# Altium project ADAS_ECU_revB.PrjPcb (part 2 of 3)

## Sheet STP_MAX96724_PINOUT.SchDoc
size D; SheetNumber: 4; SheetTotal: 19
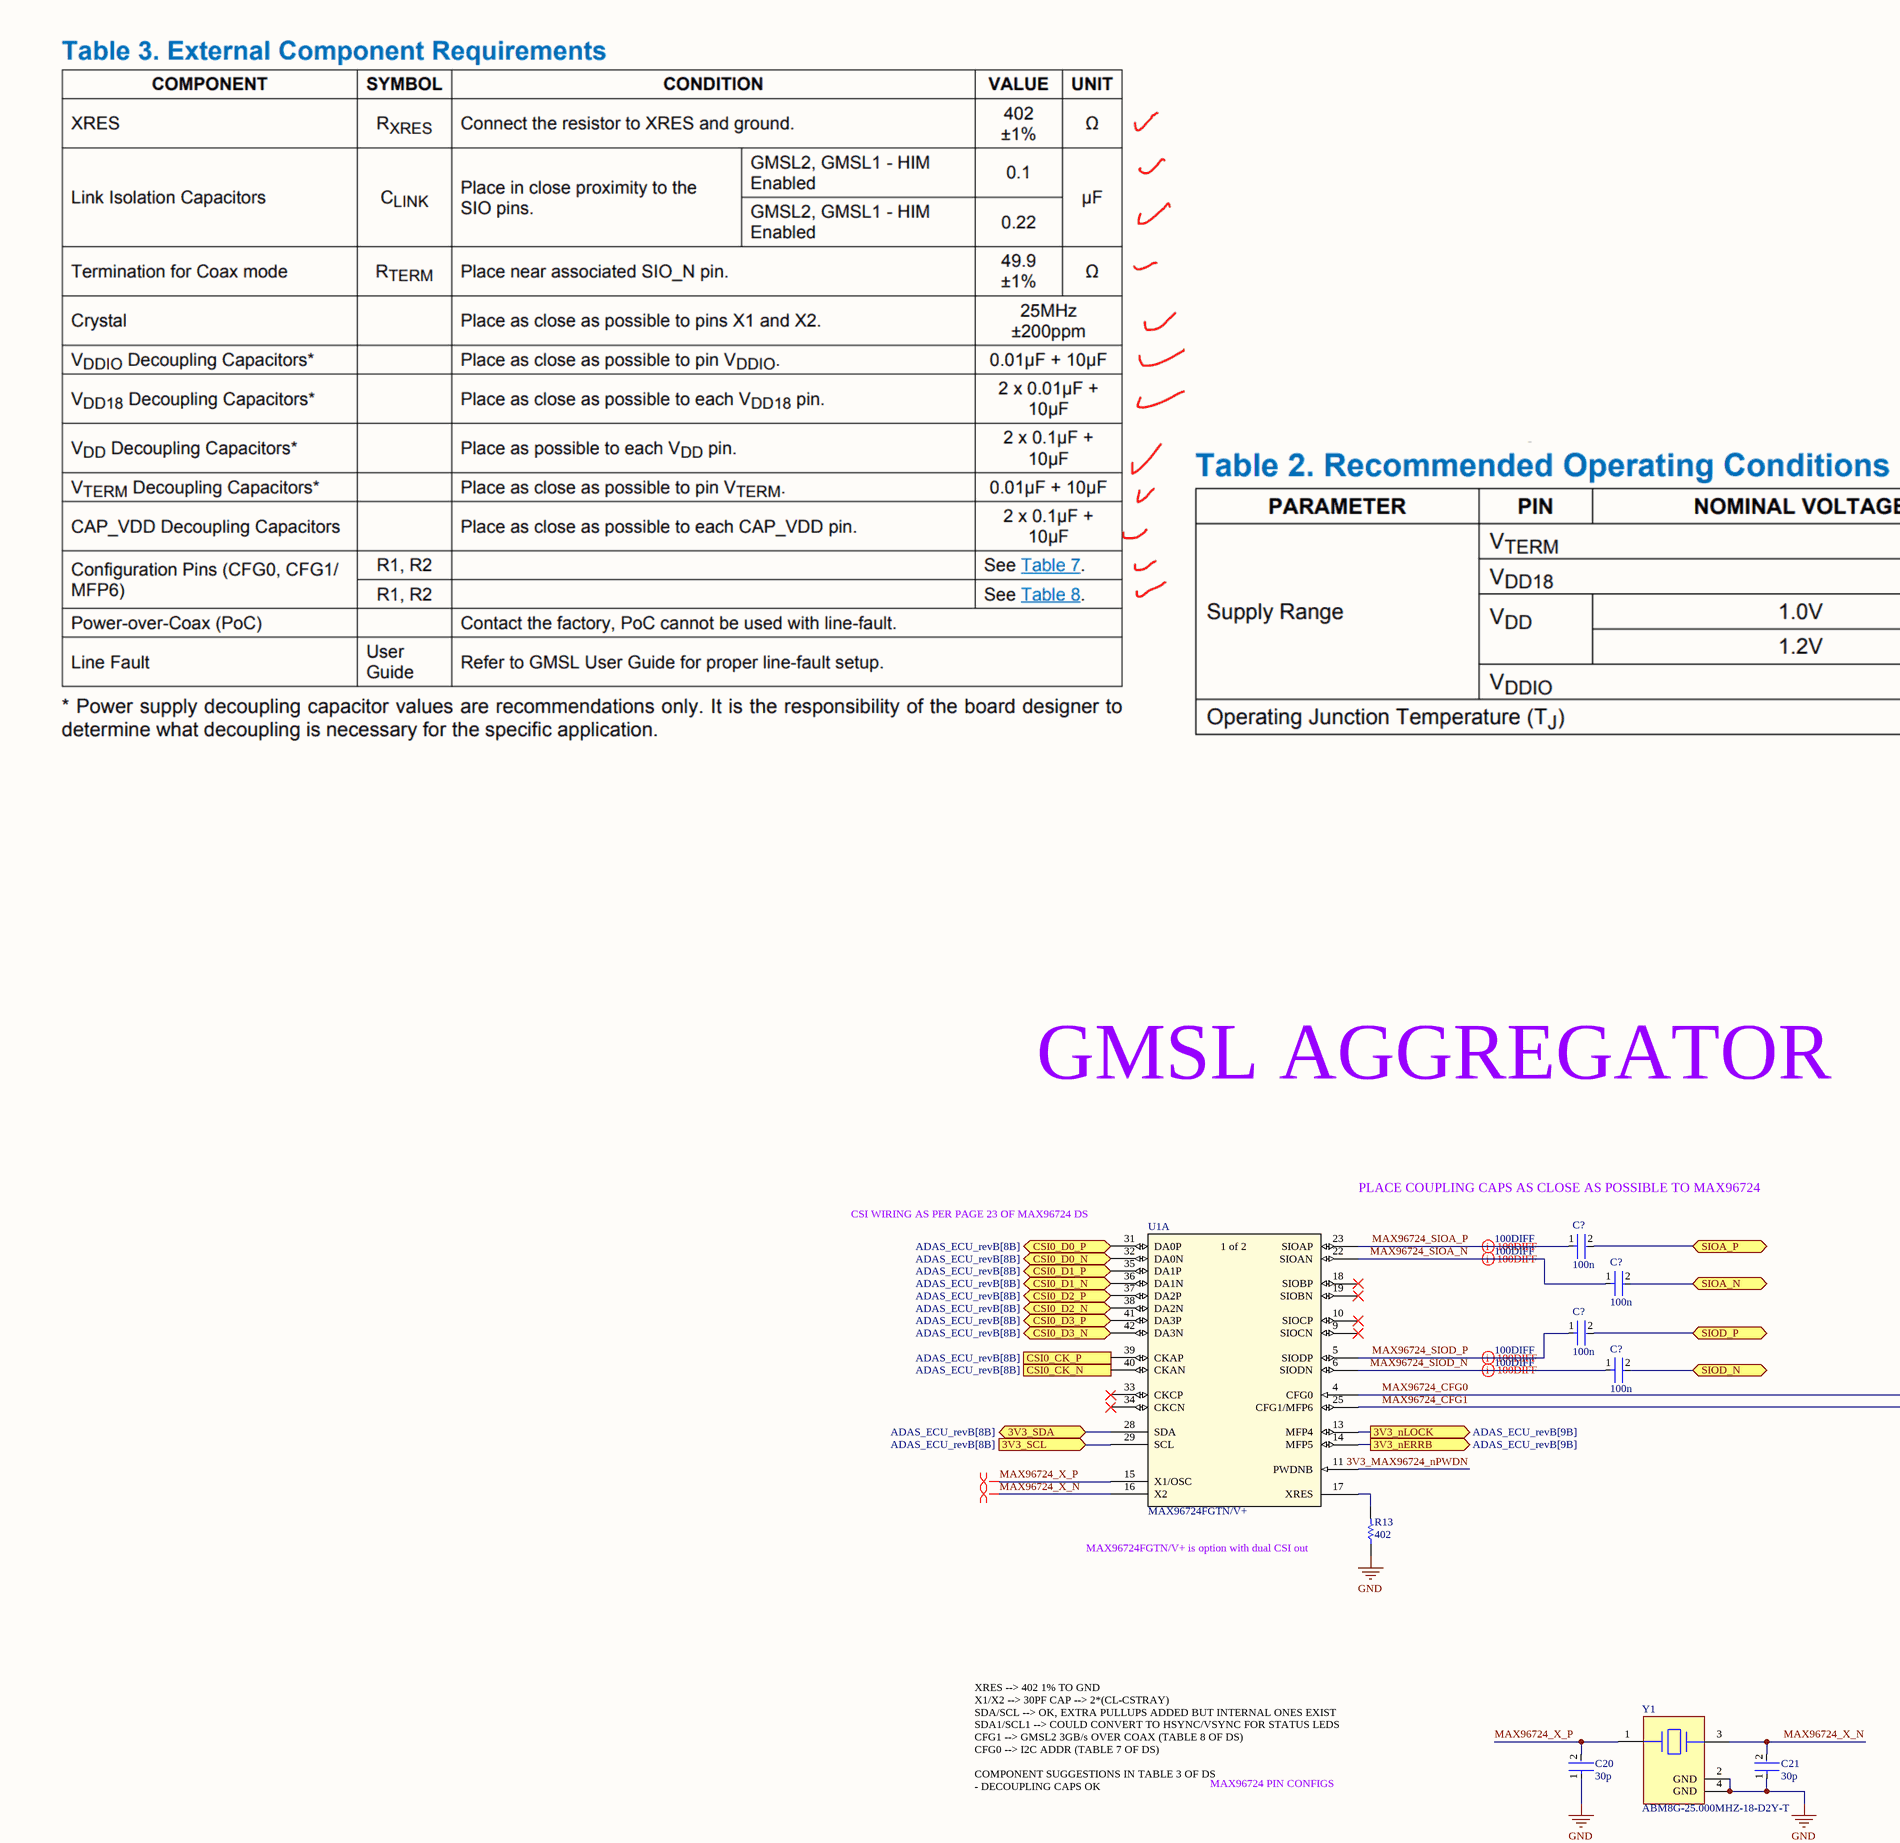
[diagram p10: STP_MAX96724_PINOUT.SchDoc, top left]
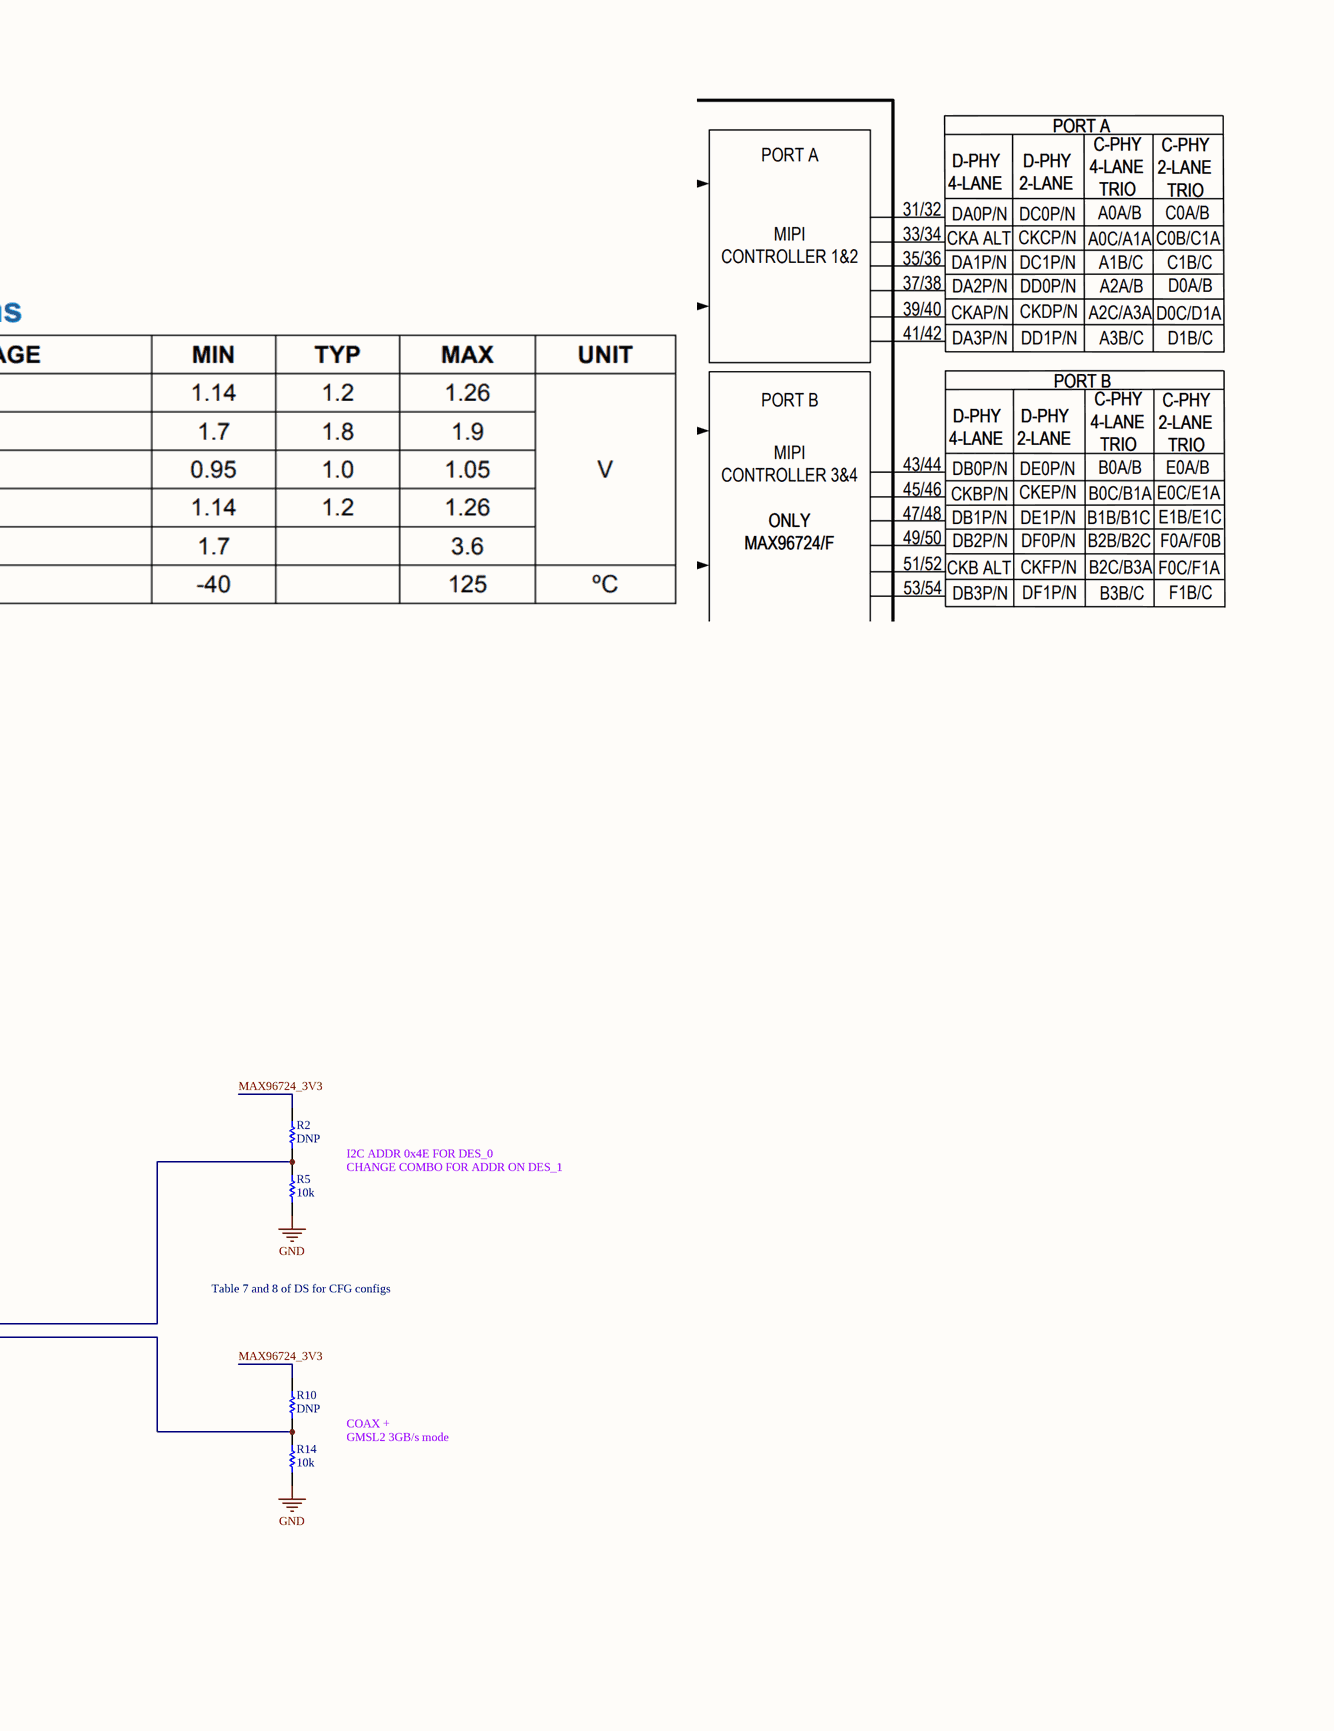
[diagram p11: STP_MAX96724_PINOUT.SchDoc, top right]
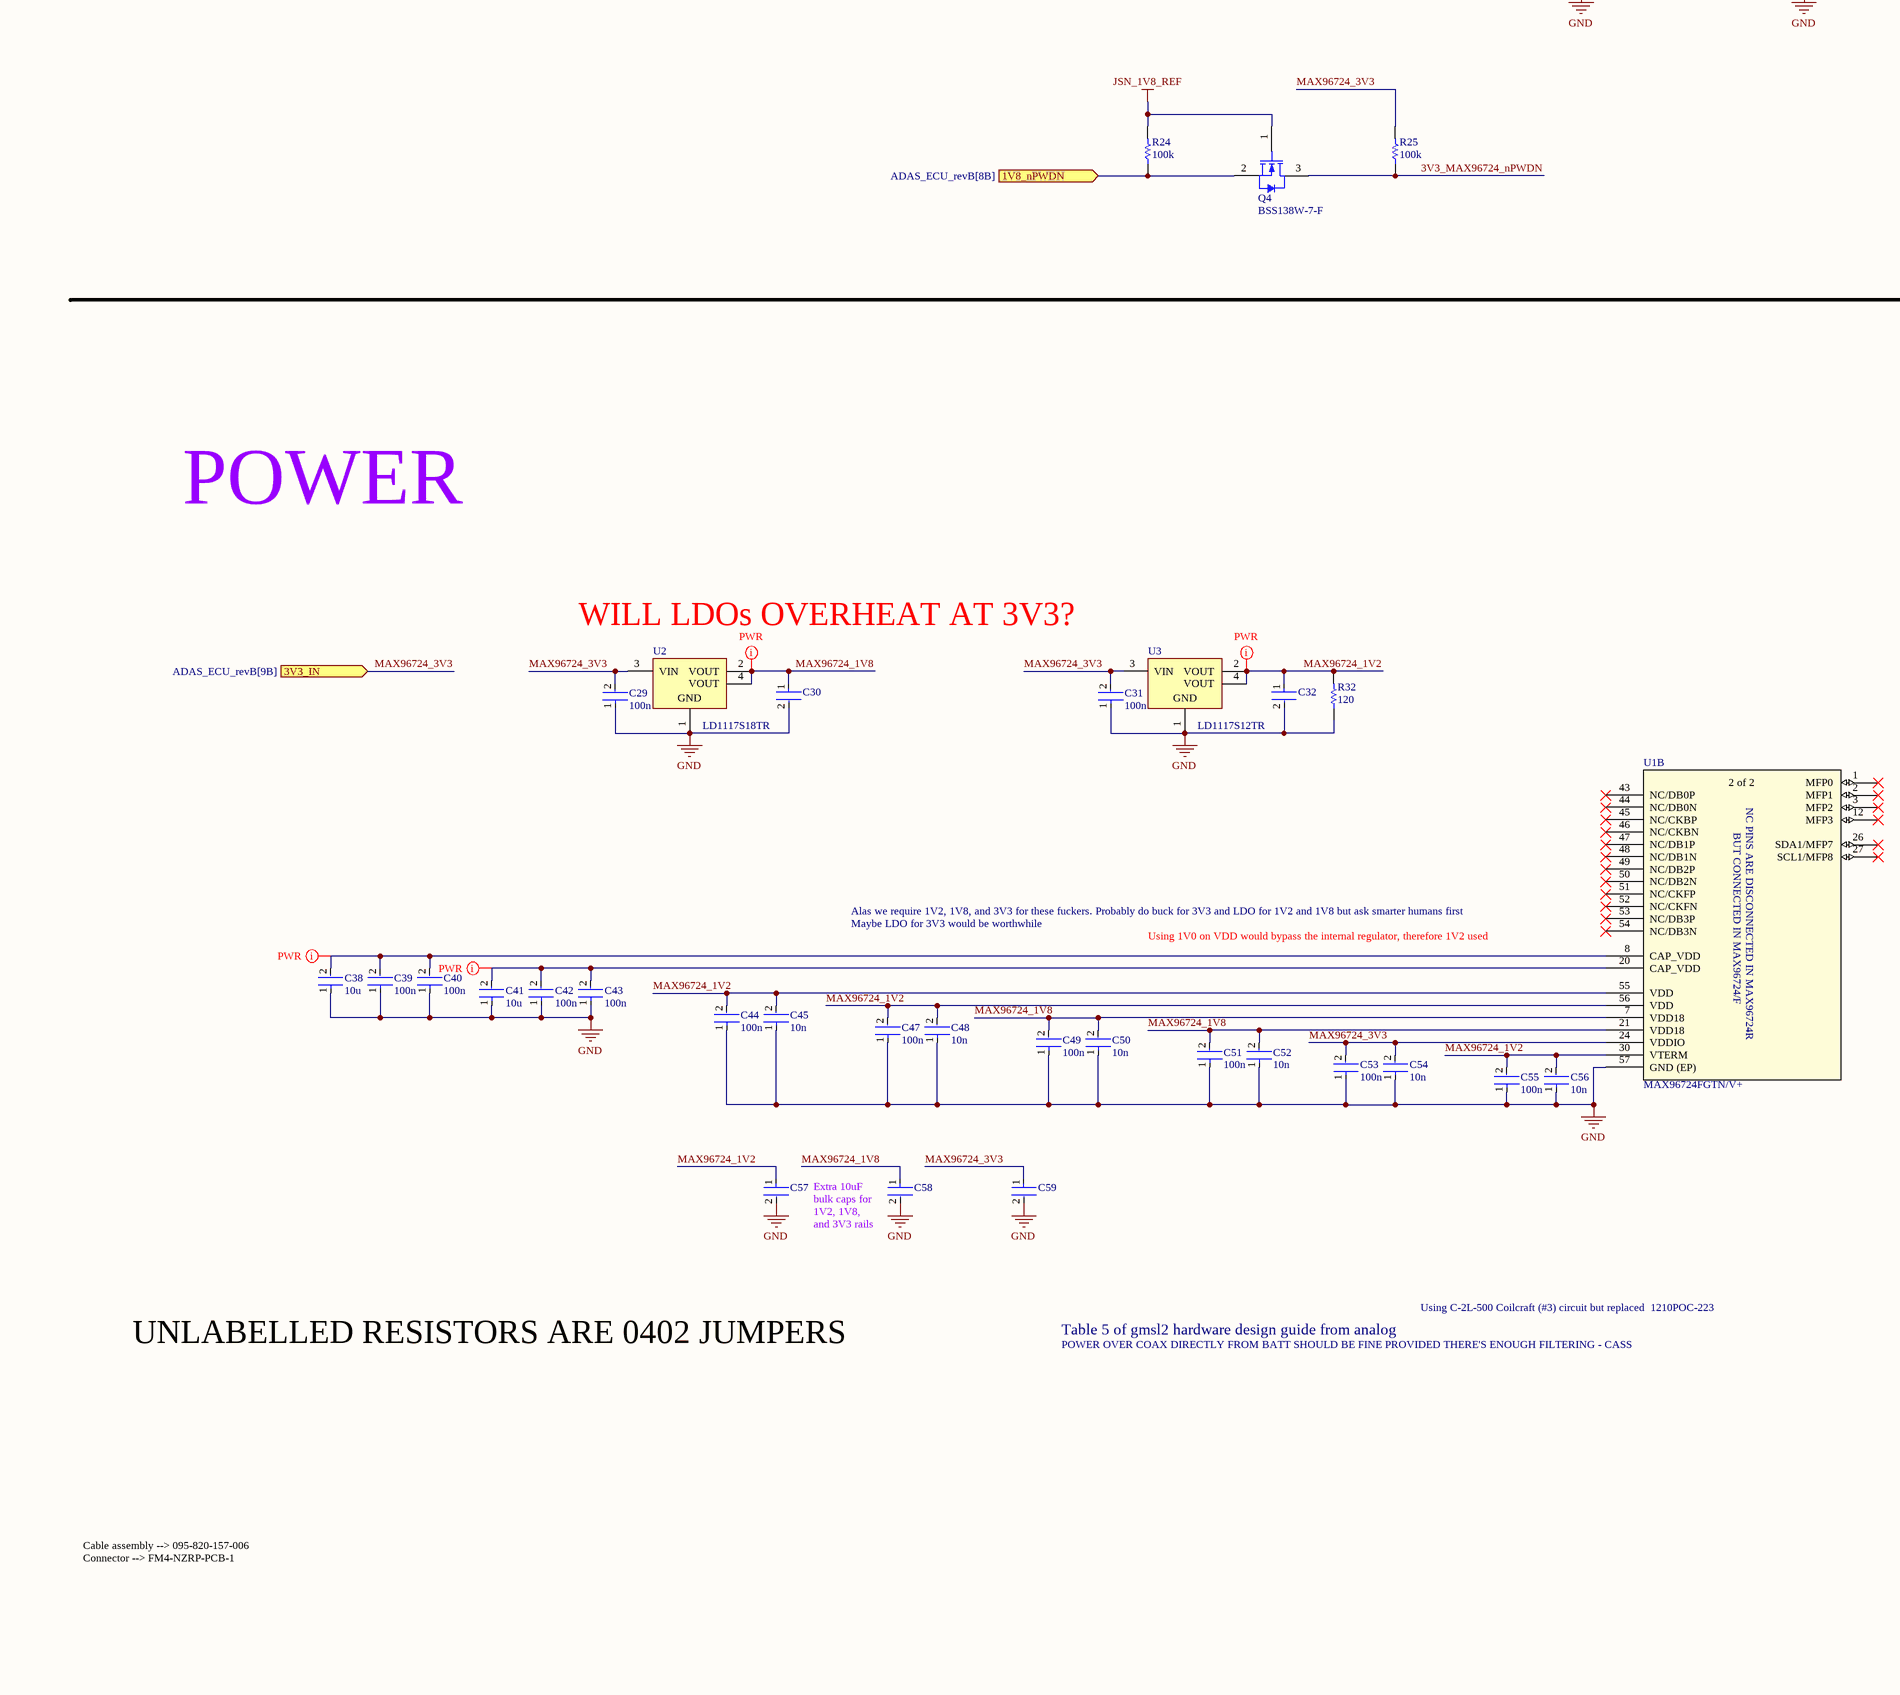
[diagram p12: STP_MAX96724_PINOUT.SchDoc, bottom left]
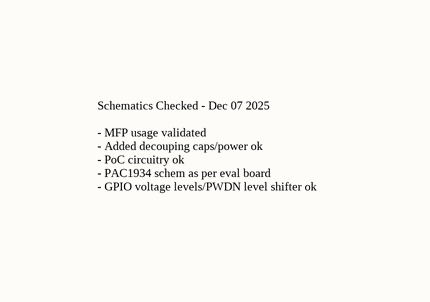
[diagram p13: STP_MAX96724_PINOUT.SchDoc, bottom right]

### Parts
(Parts that share a designator on the sheet are numbered #1, #2 ... from top to bottom, then left to right.)
C20  30p  [FP-0402-L_1_0_0_05-W_0_5-IPC_A]
C21  30p  [FP-0402-L_1_0_0_05-W_0_5-IPC_A]
C29  100n  [FP-0402-L_1_0_0_05-W_0_5-IPC_A]
C30  GRM188R60J106ME47D  [FP-GRM188-0_1-e0_2_0_55-IPC_A]  (value not drawn)
C31  100n  [FP-0402-L_1_0_0_05-W_0_5-IPC_A]
C32  GRM188R60J106ME47D  [FP-GRM188-0_1-e0_2_0_55-IPC_A]  (value not drawn)
C38  10u  [FP-0402-L_1_0_0_05-W_0_5-IPC_A]
C39  100n  [FP-0402-L_1_0_0_05-W_0_5-IPC_A]
C40  100n  [FP-0402-L_1_0_0_05-W_0_5-IPC_A]
C41  10u  [FP-0402-L_1_0_0_05-W_0_5-IPC_A]
C42  100n  [FP-0402-L_1_0_0_05-W_0_5-IPC_A]
C43  100n  [FP-0402-L_1_0_0_05-W_0_5-IPC_A]
C44  100n  [FP-0402-L_1_0_0_05-W_0_5-IPC_A]
C45  10n  [FP-0402-L_1_0_0_05-W_0_5-IPC_A]
C47  100n  [FP-0402-L_1_0_0_05-W_0_5-IPC_A]
C48  10n  [FP-0402-L_1_0_0_05-W_0_5-IPC_A]
C49  100n  [FP-0402-L_1_0_0_05-W_0_5-IPC_A]
C50  10n  [FP-0402-L_1_0_0_05-W_0_5-IPC_A]
C51  100n  [FP-0402-L_1_0_0_05-W_0_5-IPC_A]
C52  10n  [FP-0402-L_1_0_0_05-W_0_5-IPC_A]
C53  100n  [FP-0402-L_1_0_0_05-W_0_5-IPC_A]
C54  10n  [FP-0402-L_1_0_0_05-W_0_5-IPC_A]
C55  100n  [FP-0402-L_1_0_0_05-W_0_5-IPC_A]
C56  10n  [FP-0402-L_1_0_0_05-W_0_5-IPC_A]
C57  EMK107BBJ106MA-T  [FP-0603-L_1_6_0_2-W_0_8_0-MFG]  (value not drawn)
C58  EMK107BBJ106MA-T  [FP-0603-L_1_6_0_2-W_0_8_0-MFG]  (value not drawn)
C59  EMK107BBJ106MA-T  [FP-0603-L_1_6_0_2-W_0_8_0-MFG]  (value not drawn)
C?#21  100n  [FP-0402-L_1_0_0_05-W_0_5-IPC_A]
C?#22  100n  [FP-0402-L_1_0_0_05-W_0_5-IPC_A]
C?#23  100n  [FP-0402-L_1_0_0_05-W_0_5-IPC_A]
C?#24  100n  [FP-0402-L_1_0_0_05-W_0_5-IPC_A]
Q4  BSS138W-7-F  [DIOD-SOT323-3_V]
R2  DNP  [R0603B]
R5  10k  [R0603B]
R10  DNP  [R0603B]
R13  402  [R0603B]
R14  10k  [R0603B]
R24  100k  [R0603B]
R25  100k  [R0603B]
R32  120  [R0603B]
U1  MAX96724FGTN/V+  [MAX96724FGTN_V+-Footprint-1]  (parts A,B of 2)
U2  LD1117S18TR  [SOT-223_M]
U3  LD1117S12TR  [SOT-223_M]
Y1  ABM8G-25.000MHZ-18-D2Y-T  [FP-ABM8G-MFG]

### Ports
1V8_nPWDN (in, see ADAS_ECU_revB[8B]), 3V3_IN (in, see ADAS_ECU_revB[9B]), 3V3_nERRB (out, see ADAS_ECU_revB[9B]), 3V3_nLOCK (out, see ADAS_ECU_revB[9B]), 3V3_SCL (in, see ADAS_ECU_revB[8B]), 3V3_SDA (bidir, see ADAS_ECU_revB[8B]), CSI0_CK_N (in, see ADAS_ECU_revB[8B]), CSI0_CK_P (in, see ADAS_ECU_revB[8B]), CSI0_D0_N (bidir, see ADAS_ECU_revB[8B]), CSI0_D0_P (bidir, see ADAS_ECU_revB[8B]), CSI0_D1_N (bidir, see ADAS_ECU_revB[8B]), CSI0_D1_P (bidir, see ADAS_ECU_revB[8B]), CSI0_D2_N (bidir, see ADAS_ECU_revB[8B]), CSI0_D2_P (bidir, see ADAS_ECU_revB[8B]), CSI0_D3_N (bidir, see ADAS_ECU_revB[8B]), CSI0_D3_P (bidir, see ADAS_ECU_revB[8B]), SIOA_N (bidir), SIOA_P (bidir), SIOD_N (bidir), SIOD_P (bidir)

### Nets
GND: C20.1 C21.1 C29.1 C30.2 C31.1 C32.2 C38.1 C39.1 C40.1 C41.1 C42.1 C43.1 C44.1 C45.1 C47.1 C48.1 C49.1 C50.1 C51.1 C52.1 C53.1 C54.1 C55.1 C56.1 C57.2 C58.2 C59.2 R5.1 R13.1 R14.1 R32.1 U1.57(GND_(EP)) U2.1(GND) U3.1(GND) Y1.2(GND) Y1.4(GND)
JSN_1V8_REF: Q4.1(G) R24.2
MAX96724_3V3: C29.2 C31.2 C53.2 C54.2 C59.1 R2.2 R10.2 R25.2 U1.24(VDDIO) U2.3(VIN) U3.3(VIN) ; port 3V3_IN
3V3_MAX96724_nPWDN: Q4.3(D) R25.1 U1.11(PWDNB)
MAX96724_1V2: C32.1 C44.2 C45.2 C47.2 C48.2 C55.2 C56.2 C57.1 R32.2 U1.30(VTERM) U1.55(VDD) U1.56(VDD) U3.2(VOUT) U3.4(VOUT)
MAX96724_1V8: C30.1 C49.2 C50.2 C51.2 C52.2 C58.1 U1.7(VDD18) U1.21(VDD18) U2.2(VOUT) U2.4(VOUT)
MAX96724_CFG0: R2.1 R5.2 U1.4(CFG0)
MAX96724_CFG1: R10.1 R14.2 U1.25(CFG1/MFP6)
MAX96724_SIOA_N: C?#22.1 U1.22(SIOAN)
MAX96724_SIOA_P: C?#21.1 U1.23(SIOAP)
MAX96724_SIOD_N: C?#24.1 U1.6(SIODN)
MAX96724_SIOD_P: C?#23.1 U1.5(SIODP)
MAX96724_X_N: C21.2 U1.16(X2) Y1.3
MAX96724_X_P: C20.2 U1.15(X1/OSC) Y1.1
RF_MAX96724_2_A_N: C?#22.2 ; port SIOA_N
RF_MAX96724_2_A_P: C?#21.2 ; port SIOA_P
RF_MAX96724_2_D_N: C?#24.2 ; port SIOD_N
RF_MAX96724_2_D_P: C?#23.2 ; port SIOD_P
NetC38_2: C38.2 C39.2 C40.2 U1.8(CAP_VDD)
NetC41_2: C41.2 C42.2 C43.2 U1.20(CAP_VDD)
NetQ4_2: Q4.2(S) R24.1 ; port 1V8_nPWDN
NetR13_2: R13.2 U1.17(XRES)
NetU1_13: U1.13(MFP4) ; port 3V3_nLOCK
NetU1_14: U1.14(MFP5) ; port 3V3_nERRB
NetU1_28: U1.28(SDA) ; port 3V3_SDA
NetU1_29: U1.29(SCL) ; port 3V3_SCL
NetU1_31: U1.31(DA0P) ; port CSI0_D0_P
NetU1_32: U1.32(DA0N) ; port CSI0_D0_N
NetU1_35: U1.35(DA1P) ; port CSI0_D1_P
NetU1_36: U1.36(DA1N) ; port CSI0_D1_N
NetU1_37: U1.37(DA2P) ; port CSI0_D2_P
NetU1_38: U1.38(DA2N) ; port CSI0_D2_N
NetU1_39: U1.39(CKAP) ; port CSI0_CK_P
NetU1_40: U1.40(CKAN) ; port CSI0_CK_N
NetU1_41: U1.41(DA3P) ; port CSI0_D3_P
NetU1_42: U1.42(DA3N) ; port CSI0_D3_N

Not connected (* = marked no-connect by the designer): U1 1(MFP0)* 2(MFP1)* 3(MFP2)* 9(SIOCN)* 10(SIOCP)* 12(MFP3)* 18(SIOBP)* 19(SIOBN)* 26(SDA1/MFP7)* 27(SCL1/MFP8)* 33(CKCP)* 34(CKCN)* 43(NC/DB0P)* 44(NC/DB0N)* 45(NC/CKBP)* 46(NC/CKBN)* 47(NC/DB1P)* 48(NC/DB1N)* 49(NC/DB2P)* 50(NC/DB2N)* 51(NC/CKFP)* 52(NC/CKFN)* 53(NC/DB3P)* 54(NC/DB3N)*

### Layout directives
differential pair: MAX96724_X_N, MAX96724_X_P
differential pair; differential pair class 100DIFF: MAX96724_SIOA_N, MAX96724_SIOA_P, MAX96724_SIOD_N, MAX96724_SIOD_P
net class PWR: MAX96724_1V2, MAX96724_1V8, NetC38_2, NetC41_2

### Notes on the sheet
- GMSL AGGREGATOR
- PLACE COUPLING CAPS AS CLOSE AS POSSIBLE TO MAX96724
- CSI WIRING AS PER PAGE 23 OF MAX96724 DS
- I2C ADDR 0x4E FOR DES_0
- CHANGE COMBO FOR ADDR ON DES_1
- Table 7 and 8 of DS for CFG configs
- GMSL2 3GB/s mode
- COAX +
- MAX96724FGTN/V+ is option with dual CSI out
- XRES --> 402 1% TO GND
  X1/X2 --> 30PF CAP --> 2*(CL-CSTRAY)
  SDA/SCL --> OK, EXTRA PULLUPS ADDED BUT INTERNAL ONES EXIST
  SDA1/SCL1 --> COULD CONVERT TO HSYNC/VSYNC FOR STATUS LEDS
  CFG1 --> GMSL2 3GB/s OVER COAX (TABLE 8 OF DS)
  CFG0 --> I2C ADDR (TABLE 7 OF DS)
  COMPONENT SUGGESTIONS IN TABLE 3 OF DS
  - DECOUPLING CAPS OK
- MAX96724 PIN CONFIGS
- POWER
- WILL LDOs OVERHEAT AT 3V3?
- Alas we require 1V2, 1V8, and 3V3 for these fuckers. Probably do buck for 3V3 and LDO for 1V2 and 1V8 but ask smarter humans first
- Maybe LDO for 3V3 would be worthwhile
- Using 1V0 on VDD would bypass the internal regulator, therefore 1V2 used
- Extra 10uF bulk caps for 1V2, 1V8, and 3V3 rails
- Using C-2L-500 Coilcraft (#3) circuit but replaced  1210POC-223
- UNLABELLED RESISTORS ARE 0402 JUMPERS
- Table 5 of gmsl2 hardware design guide from analog
- POWER OVER COAX DIRECTLY FROM BATT SHOULD BE FINE PROVIDED THERE'S ENOUGH FILTERING - CASS
- Schematics Checked - Dec 07 2025
  - MFP usage validated
  - Added decouping caps/power ok
  - PoC circuitry ok
  - PAC1934 schem as per eval board
  - GPIO voltage levels/PWDN level shifter ok
- Cable assembly --> 095-820-157-006
  Connector --> FM4-NZRP-PCB-1
- (in symbol CMP-015-00011-4, part A) 1 of 2
- (in symbol CMP-015-00011-4, part B) 2 of 2; NC PINS ARE DISCONNECTED IN MAX96724R; BUT CONNECTED IN MAX96724/F

### Library data of the parts
C20 C21 C29 C31 C38-C45 C47-C56 C?#21-C?#24 = CMP-001-00058-1: as C?#1 on sheet ADAS_ECU_revB; Min Operating Temperature: -55°C; Mounting Technology: Surface Mount; Pins: 2; Case/Package: 0402; RoHS Compliant: Yes; Max Operating Temperature: 85°C
C30 C32 = CMP-2006-02792-2: as C30 on sheet MAX96724_PINOUT; Packaging: Tape and Reel; Voltage Rating (DC): 6.3V; Width: 0.031inch; Termination: SMD/SMT; Dielectric: X5R; Package Quantity: 4000; Voltage Rating: 6.3V; Capacitance: 10uF; Case/Package: 0603; Min Operating Temperature: -55°C; Voltage: 6.3V; Length: 1.6mm; Thickness: 0.035inch; Lead Free: Lead Free; Depth: 0.8mm; Case Code (Imperial): 0603; Max Operating Temperature: 85°C; Material: Ceramic; Height: 0.8mm; Tolerance: 20%; Mount: Surface Mount; REACH SVHC: No SVHC; Radiation Hardening: No; Case Code (Metric): 1608
C57-C59 = CMP-2000-06226-4: Multilayer Ceramic Capacitor 10uF 16V X5R 20% SMD 0603 T/R; Packaging: Tape and Reel; Construction: Flat; Height: 0.8mm; Max Operating Temperature: 85°C; Dielectric: X5R; Case Code (Metric): 1608; Voltage Rating (DC): 16V; Width: 0.031inch; Voltage Rating: 16V; Length: 0.063inch; RoHS Compliant: Yes; Halogen Free: Halogen Free; Case Code (Imperial): 0603; Capacitance: 10uF; Mount: Surface Mount; Thickness: 0.031inch; Tolerance: 20%; Min Operating Temperature: -55°C; Series: M; Termination: SMD/SMT; Case/Package: 0603; Package Quantity: 1
Q4 = CMP-2000-05968-1: as Q4 on sheet MAX96724_PINOUT; Manufacturer URL: http://www.diodes.com/; Series: BSS138; Package Description: 3-Pin Small Outline Transistor, Body 2 x 1.25 mm, Pitch 0.65 mm; Mounting Technology: SurfaceMount; Product Category: MOSFET; RoHS: True; Maximum Operating Temperature: +150C; Height: 1mm; Length: 2.2mm; Technology: Si; Width: 1.35mm; Datasheet URL: http://www.diodes.com/_files/datasheets/ds30206.pdf; Manufacturer: DiodesIncorporated; Package / Case: SOT-323-3; Typical Turn-On Delay Time: 20ns; Transistor Polarity: N-Channel; Factory Pack Quantity: 3000; Packaging: Reel; Product: MOSFETSmallSignal; Datasheet Version: Rev. 11-2, 09/2013; Package Reference: SOT323; Minimum Operating Temperature: -55C; Mounting Style: SMD/SMT; Channel Mode: Enhancement
R2 R5 R10 R13 R14 R24 R25 R32 = CMP-009-00002-14: Resistor
U1 = CMP-015-00011-4: Quad Tunneling GMSL2/1 to CSI-2 Deserializer
U2 = CMP-0244-00308-1: as U2 on sheet MAX96724_PINOUT; ComponentLink1URL: http://www.st.com; PackageReference: SOT-223; PackageDescription: 4-Pin SOT-223 Package, 6.5 x 3.5 mm Body, 2.3 mm Pitch, 7 mm Lead Span; ComponentLink2URL: http://www.st.com/internet/com/TECHNICAL_RESOURCES/TECHNICAL_LITERATURE/DATASHEET/CD00000544.pdf; ComponentLink2Description: Datasheet; ComponentLink1Description: Manufacturer URL; DatasheetVersion: 1/11/2011; PackageVersion: 2010
U3 = CMP-0244-00318-1: Fixed Low Drop Positive Voltage Regulator, 1.2V, 4-Pin SOT-223, Tape and Reel; PackageDescription: 4-Pin SOT-223 Package, 6.5 x 3.5 mm Body, 2.3 mm Pitch, 7 mm Lead Span; PackageVersion: 2010; ComponentLink2Description: Datasheet; PackageReference: SOT-223; ComponentLink2URL: http://www.st.com/internet/com/TECHNICAL_RESOURCES/TECHNICAL_LITERATURE/DATASHEET/CD00000544.pdf; ComponentLink1Description: Manufacturer URL; DatasheetVersion: 1/11/2011; ComponentLink1URL: http://www.st.com
Y1 = CMP-2000-05733-3: as Y1 on sheet MAX96724_PINOUT; Length: 3.2mm; Depth: 2.5mm; Packaging: Tape and Reel; Min Operating Temperature: -40°C; Operating Frequency: 25 MHz; Lead Free: Lead Free; Number of Pins: 4; Frequency Tolerance: 20ppm; Radiation Hardening: No; Max Operating Temperature: 85°C; Termination: SMD/SMT; Frequency Stability: 30ppm; Frequency: 25MHz; Series: ABM8G; Mount: Surface Mount; Package Quantity: 1000; Height: 0.039inch; Width: 0.098inch; Case/Package: CSMD; ESR (Equivalent Series Resistance): 60R; Load Capacitance: 18pF; Tolerance: 20ppm

## Sheet MAX96751_PINOUT.SchDoc
size C; SheetNumber: 6; SheetTotal: 19
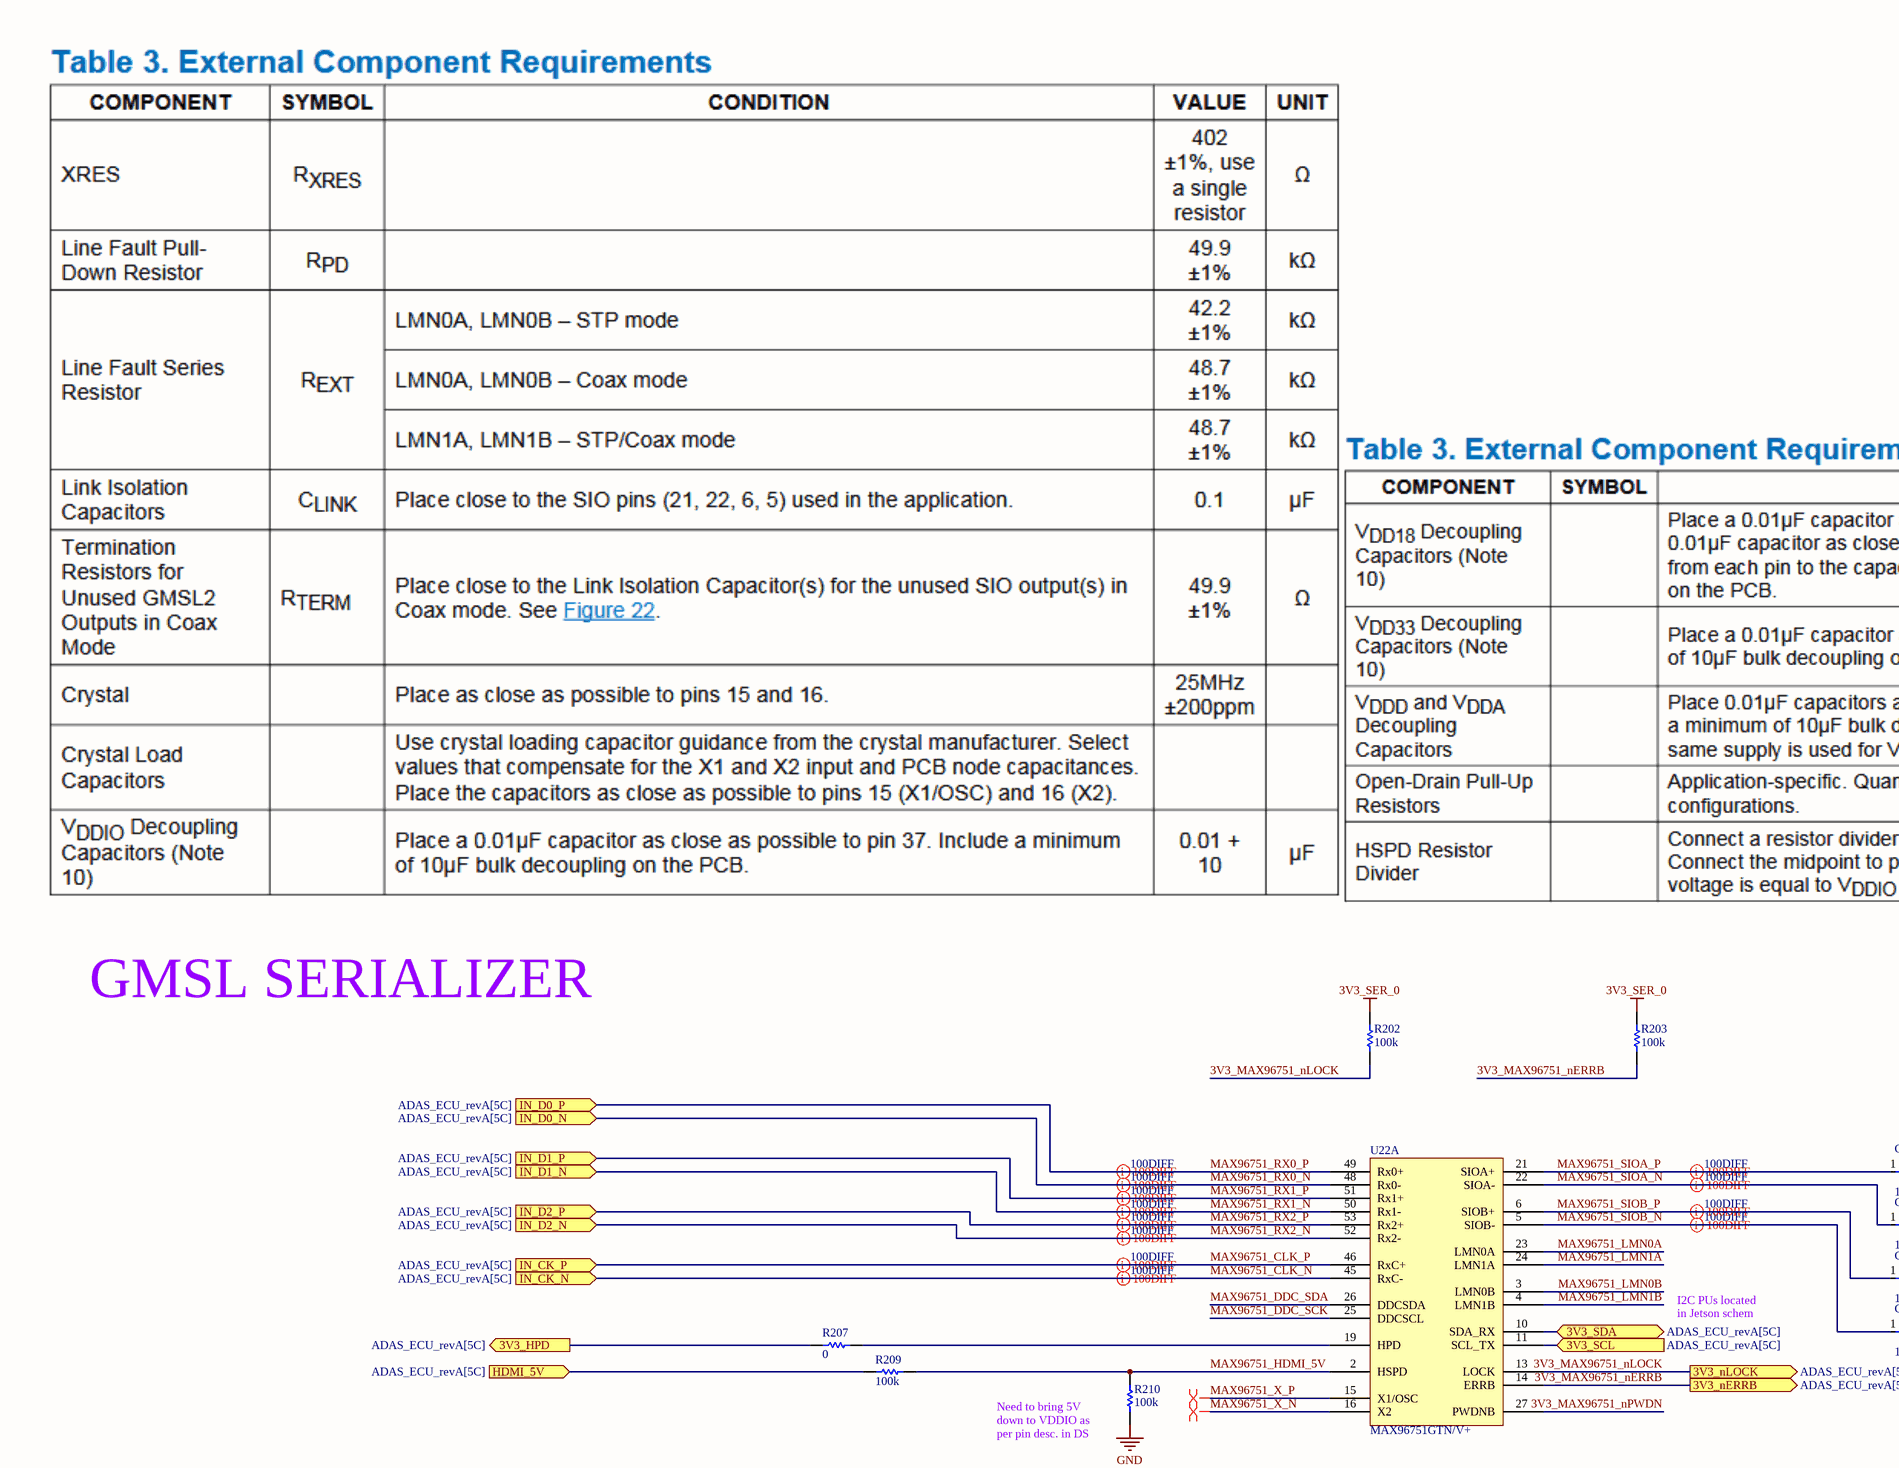
[diagram p14: MAX96751_PINOUT.SchDoc, top left]
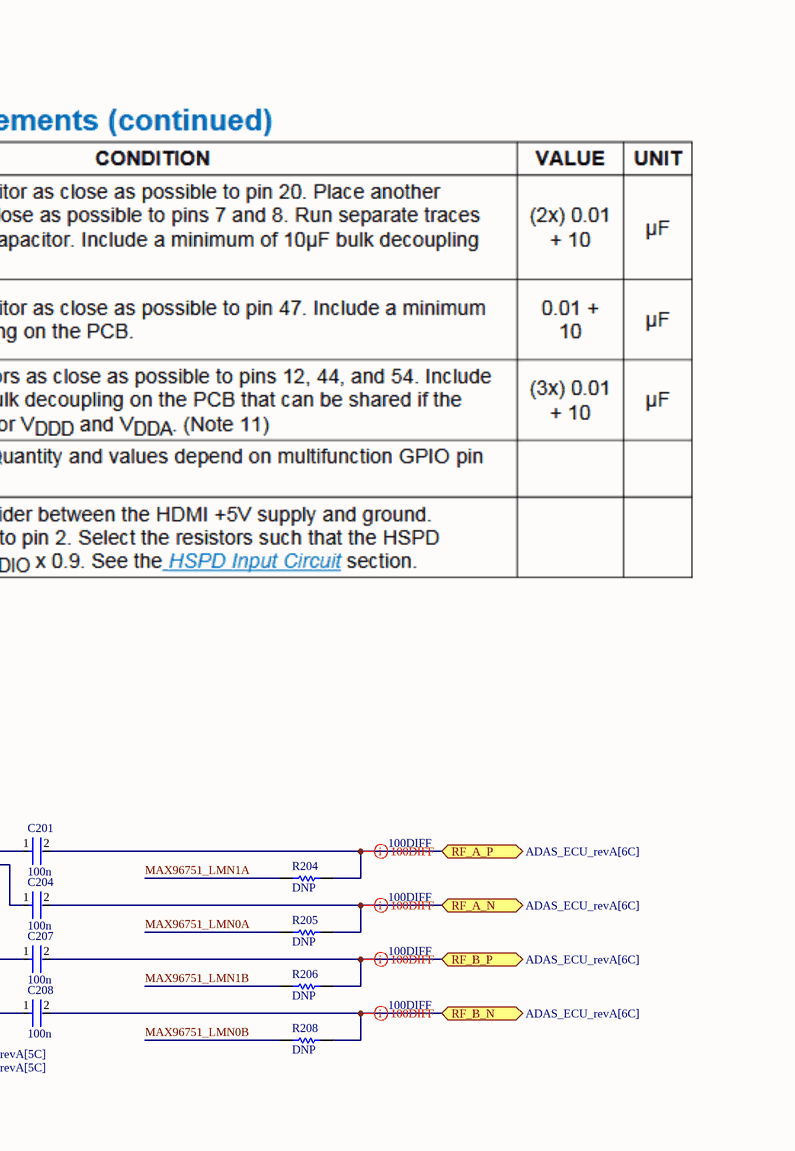
[diagram p15: MAX96751_PINOUT.SchDoc, top right]
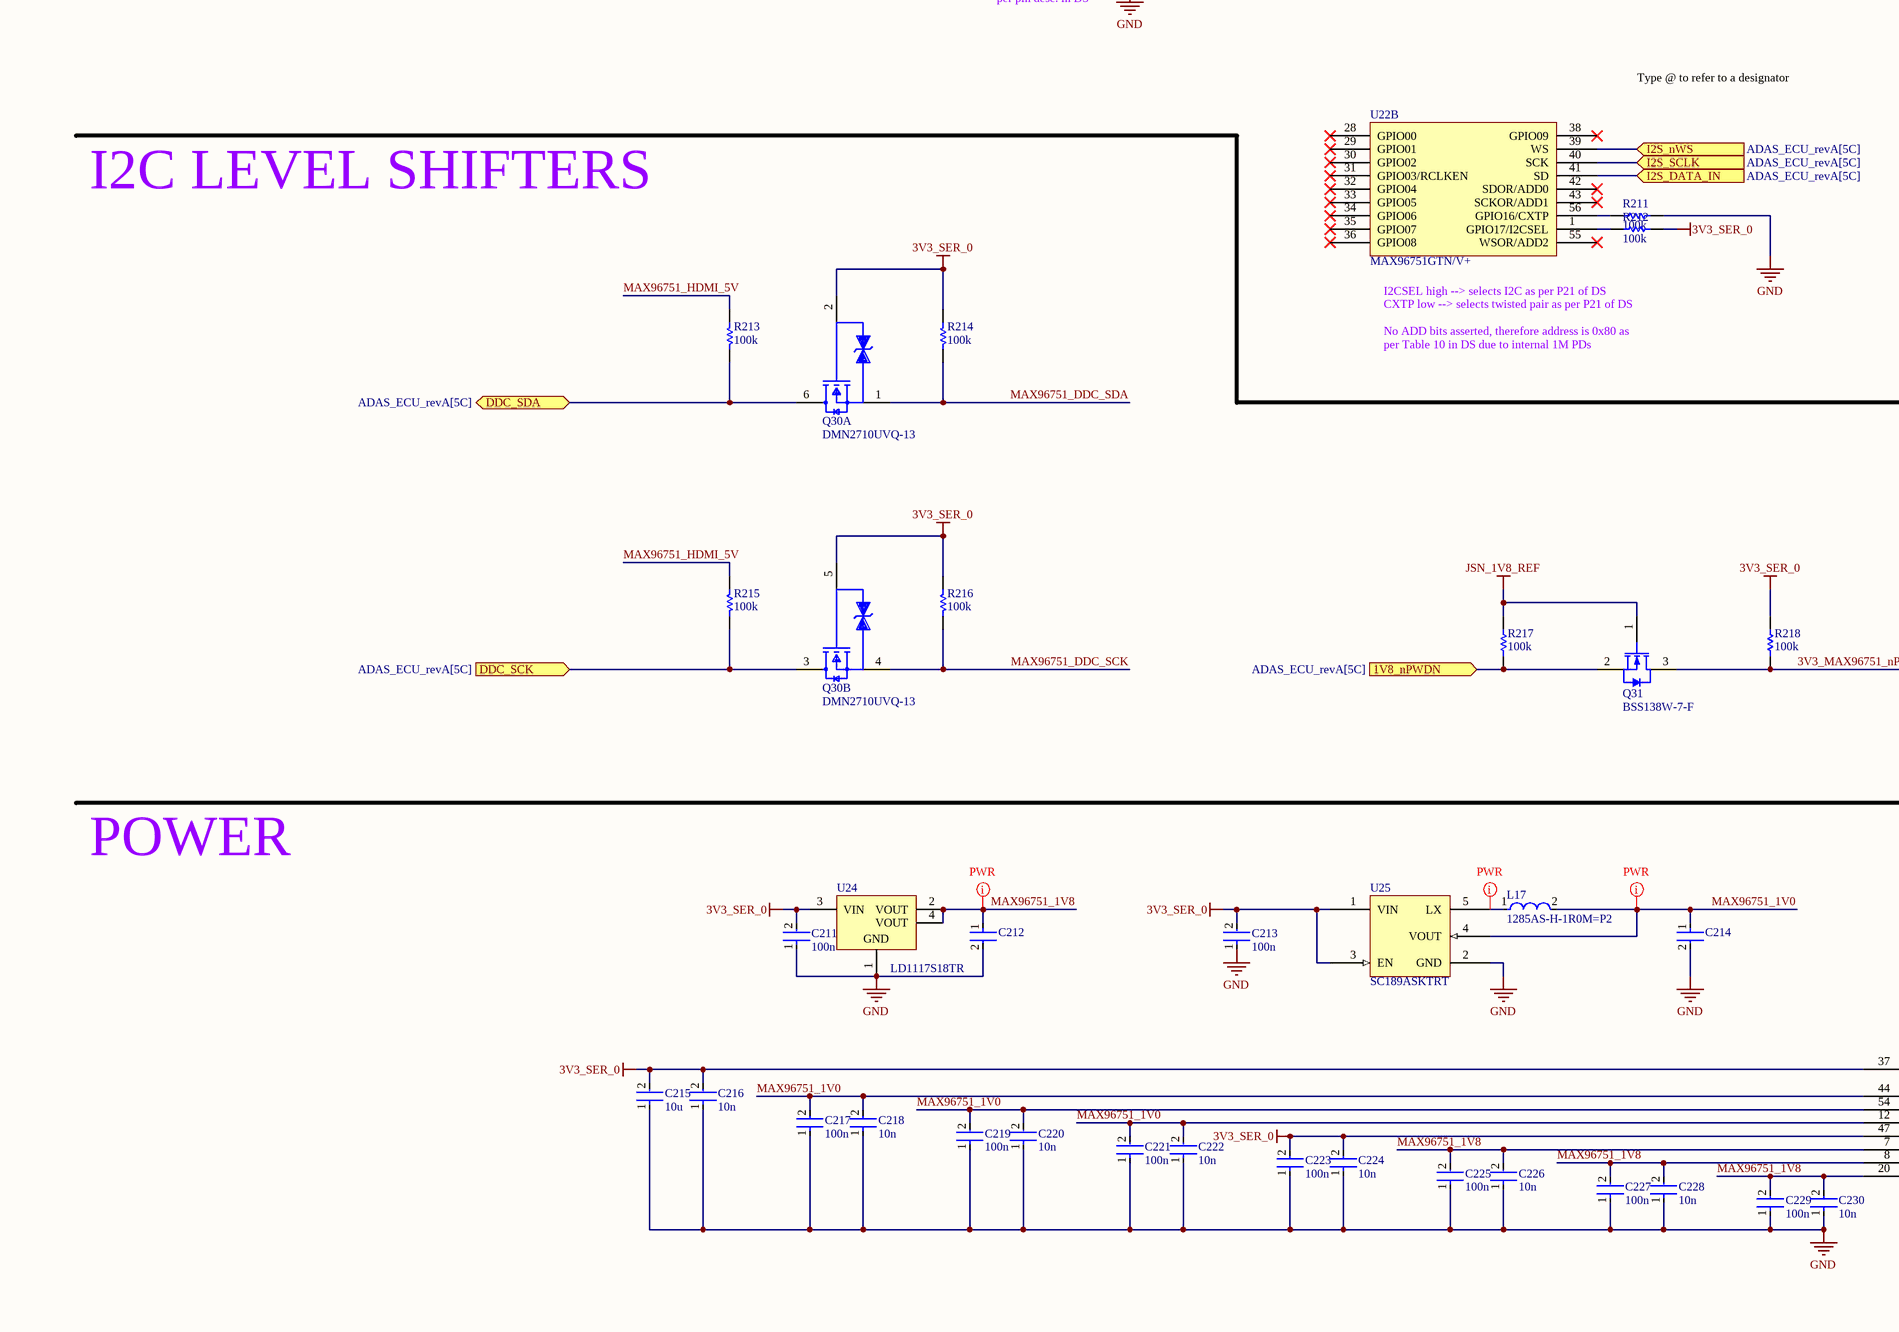
[diagram p16: MAX96751_PINOUT.SchDoc, bottom left]
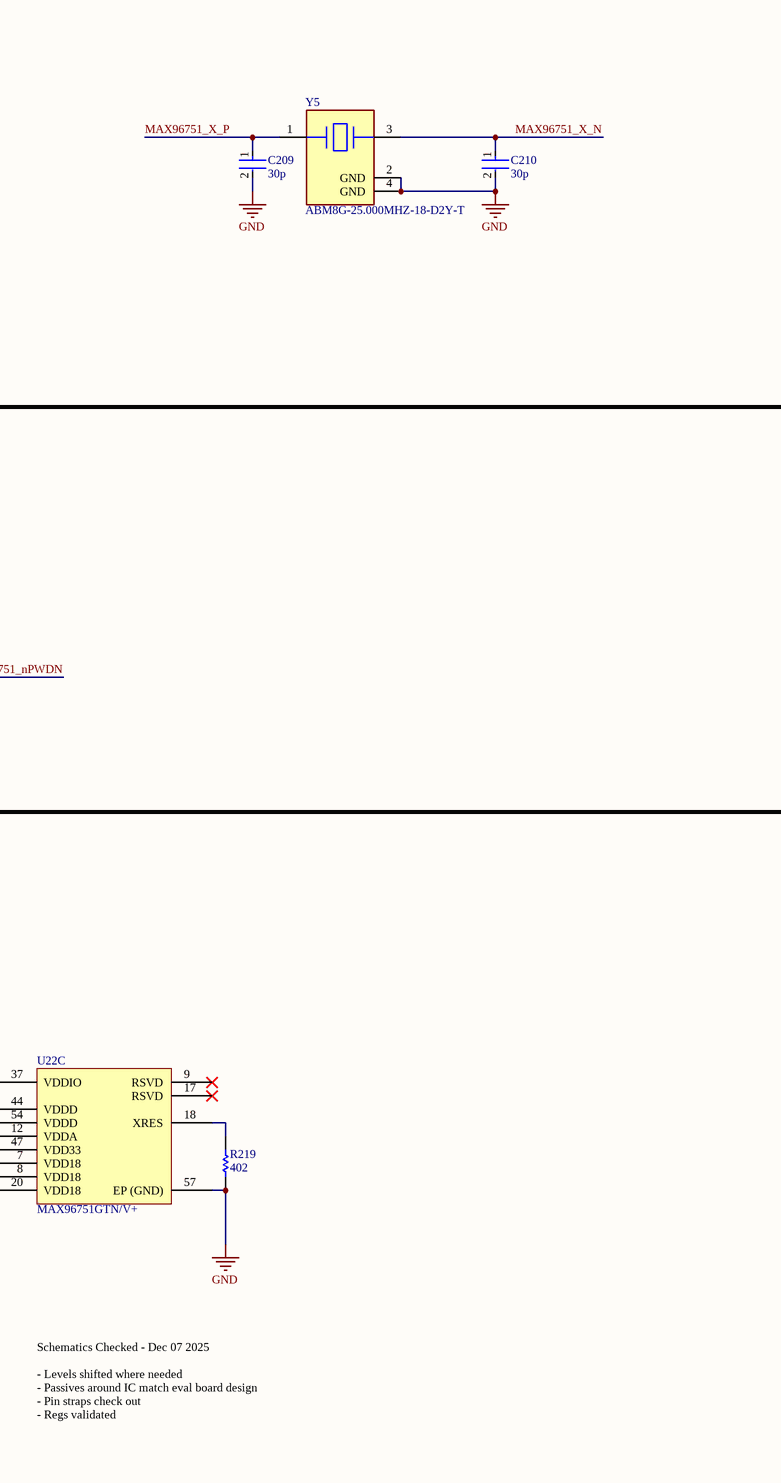
[diagram p17: MAX96751_PINOUT.SchDoc, bottom right]

### Parts
C201  100n  [FP-0402-L_1_0_0_05-W_0_5-IPC_A]
C204  100n  [FP-0402-L_1_0_0_05-W_0_5-IPC_A]
C207  100n  [FP-0402-L_1_0_0_05-W_0_5-IPC_A]
C208  100n  [FP-0402-L_1_0_0_05-W_0_5-IPC_A]
C209  30p  [FP-0402-L_1_0_0_05-W_0_5-IPC_A]
C210  30p  [FP-0402-L_1_0_0_05-W_0_5-IPC_A]
C211  100n  [FP-0402-L_1_0_0_05-W_0_5-IPC_A]
C212  GRM188R60J106ME47D  [FP-GRM188-0_1-e0_2_0_55-IPC_A]  (value not drawn)
C213  100n  [FP-0402-L_1_0_0_05-W_0_5-IPC_A]
C214  GRM21BR61E226ME44L  [FP-GRM21B-0_2-e0_2_0_7-IPC_B]  (value not drawn)
C215  10u  [FP-0402-L_1_0_0_05-W_0_5-IPC_A]
C216  10n  [FP-0402-L_1_0_0_05-W_0_5-IPC_A]
C217  100n  [FP-0402-L_1_0_0_05-W_0_5-IPC_A]
C218  10n  [FP-0402-L_1_0_0_05-W_0_5-IPC_A]
C219  100n  [FP-0402-L_1_0_0_05-W_0_5-IPC_A]
C220  10n  [FP-0402-L_1_0_0_05-W_0_5-IPC_A]
C221  100n  [FP-0402-L_1_0_0_05-W_0_5-IPC_A]
C222  10n  [FP-0402-L_1_0_0_05-W_0_5-IPC_A]
C223  100n  [FP-0402-L_1_0_0_05-W_0_5-IPC_A]
C224  10n  [FP-0402-L_1_0_0_05-W_0_5-IPC_A]
C225  100n  [FP-0402-L_1_0_0_05-W_0_5-IPC_A]
C226  10n  [FP-0402-L_1_0_0_05-W_0_5-IPC_A]
C227  100n  [FP-0402-L_1_0_0_05-W_0_5-IPC_A]
C228  10n  [FP-0402-L_1_0_0_05-W_0_5-IPC_A]
C229  100n  [FP-0402-L_1_0_0_05-W_0_5-IPC_A]
C230  10n  [FP-0402-L_1_0_0_05-W_0_5-IPC_A]
L17  1285AS-H-1R0M=P2  [FP-DFE201610C-MFG]
Q30  DMN2710UVQ-13  [SOTFL50P162X60-6N]  (parts A,B of 2)
Q31  BSS138W-7-F  [DIOD-SOT323-3_V]
R202  100k  [R0603B]
R203  100k  [R0603B]
R204  DNP  [R0603B]
R205  DNP  [R0603B]
R206  DNP  [R0603B]
R207  0  [R0603B]
R208  DNP  [R0603B]
R209  100k  [R0603B]
R210  100k  [R0603B]
R211  100k  [R0603B]
R212  100k  [R0603B]
R213  100k  [R0603B]
R214  100k  [R0603B]
R215  100k  [R0603B]
R216  100k  [R0603B]
R217  100k  [R0603B]
R218  100k  [R0603B]
R219  402  [R0603B]
U22  MAX96751GTN/V+  [QFN50P800X800X80_HS-57N]  (parts A,B,C of 3)
U24  LD1117S18TR  [SOT-223_M]
U25  SC189ASKTRT  [SOT95P275X145-5N]
Y5  ABM8G-25.000MHZ-18-D2Y-T  [FP-ABM8G-MFG]

### Ports
1V8_nPWDN (in, see ADAS_ECU_revA[5C]), 3V3_HPD (out, see ADAS_ECU_revA[5C]), 3V3_nERRB (out, see ADAS_ECU_revA[5C]), 3V3_nLOCK (out, see ADAS_ECU_revA[5C]), 3V3_SCL (in, see ADAS_ECU_revA[5C]), 3V3_SDA (bidir, see ADAS_ECU_revA[5C]), DDC_SCK (in, see ADAS_ECU_revA[5C]), DDC_SDA (bidir, see ADAS_ECU_revA[5C]), HDMI_5V (in, see ADAS_ECU_revA[5C]), I2S_DATA_IN (in, see ADAS_ECU_revA[5C]), I2S_nWS (in, see ADAS_ECU_revA[5C]), I2S_SCLK (in, see ADAS_ECU_revA[5C]), IN_CK_N (in, see ADAS_ECU_revA[5C]), IN_CK_P (in, see ADAS_ECU_revA[5C]), IN_D0_N (in, see ADAS_ECU_revA[5C]), IN_D0_P (in, see ADAS_ECU_revA[5C]), IN_D1_N (in, see ADAS_ECU_revA[5C]), IN_D1_P (in, see ADAS_ECU_revA[5C]), IN_D2_N (in, see ADAS_ECU_revA[5C]), IN_D2_P (in, see ADAS_ECU_revA[5C]), RF_A_N (bidir, see ADAS_ECU_revA[6C]), RF_A_P (bidir, see ADAS_ECU_revA[6C]), RF_B_N (bidir, see ADAS_ECU_revA[6C]), RF_B_P (bidir, see ADAS_ECU_revA[6C])

### Nets
3V3_SER_0: C211.2 C213.2 C215.2 C216.2 C223.2 C224.2 Q30.2(Gate1) Q30.5(Gate2) R202.2 R203.2 R212.2 R214.2 R216.2 R218.2 U22.37(VDDIO) U22.47(VDD33) U24.3(VIN) U25.1(VIN) U25.3(EN)
GND: C209.2 C210.2 C211.1 C212.2 C213.1 C214.2 C215.1 C216.1 C217.1 C218.1 C219.1 C220.1 C221.1 C222.1 C223.1 C224.1 C225.1 C226.1 C227.1 C228.1 C229.1 C230.1 R210.2 R211.2 R219.2 U22.57(EP_(GND)) U24.1(GND) U25.2(GND) Y5.2(GND) Y5.4(GND)
JSN_1V8_REF: Q31.1(G) R217.2
3V3_MAX96751_nERRB: R203.1 U22.14(ERRB) ; port 3V3_nERRB
3V3_MAX96751_nLOCK: R202.1 U22.13(LOCK) ; port 3V3_nLOCK
3V3_MAX96751_nPWDN: Q31.3(D) R218.1 U22.27(PWDNB)
MAX96751_1V0: C214.1 C217.2 C218.2 C219.2 C220.2 C221.2 C222.2 L17.2 U22.12(VDDA) U22.44(VDDD) U22.54(VDDD) U25.4(VOUT)
MAX96751_1V8: C212.1 C225.2 C226.2 C227.2 C228.2 C229.2 C230.2 U22.7(VDD18) U22.8(VDD18) U22.20(VDD18) U24.2(VOUT) U24.4(VOUT)
MAX96751_CLK_N: U22.45(RxC-) ; port IN_CK_N
MAX96751_CLK_P: U22.46(RxC+) ; port IN_CK_P
MAX96751_DDC_SCK: Q30.4(Source2) R216.1 U22.25(DDCSCL)
MAX96751_DDC_SDA: Q30.1(Source1) R214.1 U22.26(DDCSDA)
MAX96751_HDMI_5V: R209.1 R210.1 R213.2 R215.2 U22.2(HSPD)
MAX96751_LMN0A: R205.2 U22.23(LMN0A)
MAX96751_LMN0B: R208.2 U22.3(LMN0B)
MAX96751_LMN1A: R204.2 U22.24(LMN1A)
MAX96751_LMN1B: R206.2 U22.4(LMN1B)
MAX96751_RX0_N: U22.48(Rx0-) ; port IN_D0_N
MAX96751_RX0_P: U22.49(Rx0+) ; port IN_D0_P
MAX96751_RX1_N: U22.50(Rx1-) ; port IN_D1_N
MAX96751_RX1_P: U22.51(Rx1+) ; port IN_D1_P
MAX96751_RX2_N: U22.52(Rx2-) ; port IN_D2_N
MAX96751_RX2_P: U22.53(Rx2+) ; port IN_D2_P
MAX96751_SIOA_N: C204.1 U22.22(SIOA-)
MAX96751_SIOA_P: C201.1 U22.21(SIOA+)
MAX96751_SIOB_N: C208.1 U22.5(SIOB-)
MAX96751_SIOB_P: C207.1 U22.6(SIOB+)
MAX96751_X_N: C210.1 U22.16(X2) Y5.3
MAX96751_X_P: C209.1 U22.15(X1/OSC) Y5.1
RF_MAX96751_0_A_N: C204.2 R205.1 ; port RF_A_N
RF_MAX96751_0_A_P: C201.2 R204.1 ; port RF_A_P
RF_MAX96751_0_B_N: C208.2 R208.1 ; port RF_B_N
RF_MAX96751_0_B_P: C207.2 R206.1 ; port RF_B_P
NetL17_1: L17.1 U25.5(LX)
NetQ30_3: Q30.3(Drain2) R215.1 ; port DDC_SCK
NetQ30_6: Q30.6(Drain1) R213.1 ; port DDC_SDA
NetQ31_2: Q31.2(S) R217.1 ; port 1V8_nPWDN
NetR207_1: R207.1 U22.19(HPD)
NetR207_2: R207.2 ; port 3V3_HPD
NetR209_2: R209.2 ; port HDMI_5V
NetR211_1: R211.1 U22.56(GPIO16/CXTP)
NetR212_1: R212.1 U22.1(GPIO17/I2CSEL)
NetR219_1: R219.1 U22.18(XRES)
NetU22_10: U22.10(SDA_RX) ; port 3V3_SDA
NetU22_11: U22.11(SCL_TX) ; port 3V3_SCL
NetU22_39: U22.39(WS) ; port I2S_nWS
NetU22_40: U22.40(SCK) ; port I2S_SCLK
NetU22_41: U22.41(SD) ; port I2S_DATA_IN

Not connected (* = marked no-connect by the designer): U22 9(RSVD)* 17(RSVD)* 28(GPIO00)* 29(GPIO01)* 30(GPIO02)* 31(GPIO03/RCLKEN)* 32(GPIO04)* 33(GPIO05)* 34(GPIO06)* 35(GPIO07)* 36(GPIO08)* 38(GPIO09)* 42(SDOR/ADD0)* 43(SCKOR/ADD1)* 55(WSOR/ADD2)*

### Layout directives
differential pair: MAX96751_X_N, MAX96751_X_P
differential pair; differential pair class 100DIFF: MAX96751_CLK_N, MAX96751_CLK_P, MAX96751_RX0_N, MAX96751_RX0_P, MAX96751_RX1_N, MAX96751_RX1_P, MAX96751_RX2_N, MAX96751_RX2_P, MAX96751_SIOA_N, MAX96751_SIOA_P, MAX96751_SIOB_N, MAX96751_SIOB_P, RF_MAX96751_0_A_N, RF_MAX96751_0_A_P, RF_MAX96751_0_B_N, RF_MAX96751_0_B_P
net class PWR: MAX96751_1V0, MAX96751_1V8, NetL17_1

### Notes on the sheet
- GMSL SERIALIZER
- I2C PUs located in Jetson schem
- (near R210) Need to bring 5V down to VDDIO as per pin desc. in DS
- Type @ to refer to a designator
- I2C LEVEL SHIFTERS
- I2CSEL high --> selects I2C as per P21 of DS
  CXTP low --> selects twisted pair as per P21 of DS
  No ADD bits asserted, therefore address is 0x80 as per Table 10 in DS due to internal 1M PDs
- POWER
- Schematics Checked - Dec 07 2025
  - Levels shifted where needed
  - Passives around IC match eval board design
  - Pin straps check out
  - Regs validated

### Library data of the parts
C201 C204 C207-C211 C213 C215-C230 = CMP-001-00058-1: LARGE PADS, 0402 CAP, CHANGE COMMENT TO MATCH REAL P/N; Capacitor Type: Ceramic; Min Operating Temperature: -55°C; Mounting Technology: Surface Mount; Pins: 2; Case/Package: 0402; RoHS Compliant: Yes; Max Operating Temperature: 85°C
C212 = CMP-2006-02792-2: Chip Multilayer Ceramic Capacitors for General Purpose, 0603, 10uF, X5R, 15%, 20%, 6.3V; Packaging: Tape and Reel; Voltage Rating (DC): 6.3V; Width: 0.031inch; Termination: SMD/SMT; Dielectric: X5R; Package Quantity: 4000; Voltage Rating: 6.3V; Capacitance: 10uF; Case/Package: 0603; Min Operating Temperature: -55°C; Voltage: 6.3V; Length: 1.6mm; Thickness: 0.035inch; Lead Free: Lead Free; Depth: 0.8mm; Case Code (Imperial): 0603; Max Operating Temperature: 85°C; Material: Ceramic; Height: 0.8mm; Tolerance: 20%; Mount: Surface Mount; REACH SVHC: No SVHC; Radiation Hardening: No; Case Code (Metric): 1608
C214 = CMP-2007-03222-3: Chip Multilayer Ceramic Capacitors for General Purpose, 0805, 22uF, X5R, 15%, 20%, 25V; Case/Package: 0805; Depth: 1.25mm; Resistor Type: Ceramic; Voltage Rating: 25V; Lead Free: Lead Free; Voltage Rating (DC): 25V; Case Code (Metric): 2012; Thickness: 0.057inch; REACH SVHC: No SVHC; Material: Ceramic; Tolerance: 20%; Length: 2mm; Capacitance: 22uF; Case Code (Imperial): 0805; Max Operating Temperature: 85°C; Termination: SMD/SMT; Weight: 0.000335oz; Dielectric: X5R; Packaging: Tape and Reel; Voltage: 25V; Package Quantity: 3000; Height: 1.25mm; Mount: Surface Mount; Width: 1.25mm; Min Operating Temperature: -55°C
L17 = CMP-06042-000137-1: FIXED IND 1UH 2.2A 96 MOHM SMD; Max DC Current: 2.3A; Shielding: Shielded; Test Frequency: 1MHz; Core Material: Ferrite; Tolerance: 20%; DC Resistance (DCR): 96mR; Case Code (Metric): 2012; Case/Package: 0805; Case Code (Imperial): 0805; Resistor Type: Wirewound; Depth: 1.6mm; Width: 0.063inch; Inductance: 1uH; Max Operating Temperature: 85°C; Length: 0.079inch; Lead Free: Lead Free; Height - Seated (Max): 0.039inch; Current Rating: 2.2A; Min Operating Temperature: -40°C; Mount: Surface Mount; Packaging: Tape and Reel
Q30 = CMP-013-00023-2: MOSFET Array, Dual N Channel, 20 V, 920 mA, 450 Milliohms, SOT-563, 6 Pins; Max Operating Temperature: 150°C; Min Operating Temperature: -55°C
Q31 = CMP-2000-05968-1: N-Channel Enhancement Mode Mosfet, 50 V, 200 mA, -55 to 150 degC, 6-Pin SOT-323, RoHS, Tape and Reel; Typical Turn-Off Delay Time: 20ns; Number of Channels: 1Channel; Type: EnhancementModeFieldEffectTransistor; Brand: DiodesIncorporated; Vds - Drain-Source Breakdown Voltage: 75V; Vgs - Gate-Source Voltage: 20V; Rds On - Drain-Source Resistance: 1.4Ohms; Transistor Type: 1N-Channel; Configuration: Single; Unit Weight: 0.000212oz; Pd - Power Dissipation: 200mW; Id - Continuous Drain Current: 200mA; Forward Transconductance - Min: 0.1S; Manufacturer URL: http://www.diodes.com/; Series: BSS138; Package Description: 3-Pin Small Outline Transistor, Body 2 x 1.25 mm, Pitch 0.65 mm; Mounting Technology: SurfaceMount; Product Category: MOSFET; RoHS: True; Maximum Operating Temperature: +150C; Height: 1mm; Length: 2.2mm; Technology: Si; Width: 1.35mm; Datasheet URL: http://www.diodes.com/_files/datasheets/ds30206.pdf; Manufacturer: DiodesIncorporated; Package / Case: SOT-323-3; Typical Turn-On Delay Time: 20ns; Transistor Polarity: N-Channel; Factory Pack Quantity: 3000; Packaging: Reel; Product: MOSFETSmallSignal; Datasheet Version: Rev. 11-2, 09/2013; Package Reference: SOT323; Minimum Operating Temperature: -55C; Mounting Style: SMD/SMT; Channel Mode: Enhancement
R202-R219 = CMP-009-00002-14: Resistor
U22 = CMP-015-00018-2: GMSL2 Serializer with HDMI 2.0 Input
U24 = CMP-0244-00308-1: Fixed Low Drop Positive Voltage Regulator, 1.8V, 4-Pin SOT-223, Tape and Reel; ComponentLink1URL: http://www.st.com; PackageReference: SOT-223; PackageDescription: 4-Pin SOT-223 Package, 6.5 x 3.5 mm Body, 2.3 mm Pitch, 7 mm Lead Span; ComponentLink2URL: http://www.st.com/internet/com/TECHNICAL_RESOURCES/TECHNICAL_LITERATURE/DATASHEET/CD00000544.pdf; ComponentLink2Description: Datasheet; ComponentLink1Description: Manufacturer URL; DatasheetVersion: 1/11/2011; PackageVersion: 2010
U25 = CMP-019-00061-1: Switching Regulator, Voltage-mode, 1.5A, 3000kHz Switching Freq-Max, PDSO5; Max Supply Voltage: 5.5V; Output Voltage: 1V; Mounting Technology: Surface Mount; Case/Package: SOT-23-5; Min Operating Temperature: -40°C; Max Operating Temperature: 85°C; Pins: 6
Y5 = CMP-2000-05733-3: Crystal 25MHz ±20ppm (Tol) ±30ppm (Stability) 18pF FUND 60Ω 4-Pin SMD T/R; Series Resistance: 60R; Length: 3.2mm; Depth: 2.5mm; Packaging: Tape and Reel; Min Operating Temperature: -40°C; Operating Frequency: 25 MHz; Lead Free: Lead Free; Number of Pins: 4; Frequency Tolerance: 20ppm; Radiation Hardening: No; Max Operating Temperature: 85°C; Termination: SMD/SMT; Frequency Stability: 30ppm; Frequency: 25MHz; Series: ABM8G; Mount: Surface Mount; Package Quantity: 1000; Height: 0.039inch; Width: 0.098inch; Case/Package: CSMD; ESR (Equivalent Series Resistance): 60R; Load Capacitance: 18pF; Tolerance: 20ppm

## Sheet M2_NVME.SchDoc
size C; SheetNumber: 2; SheetTotal: 19
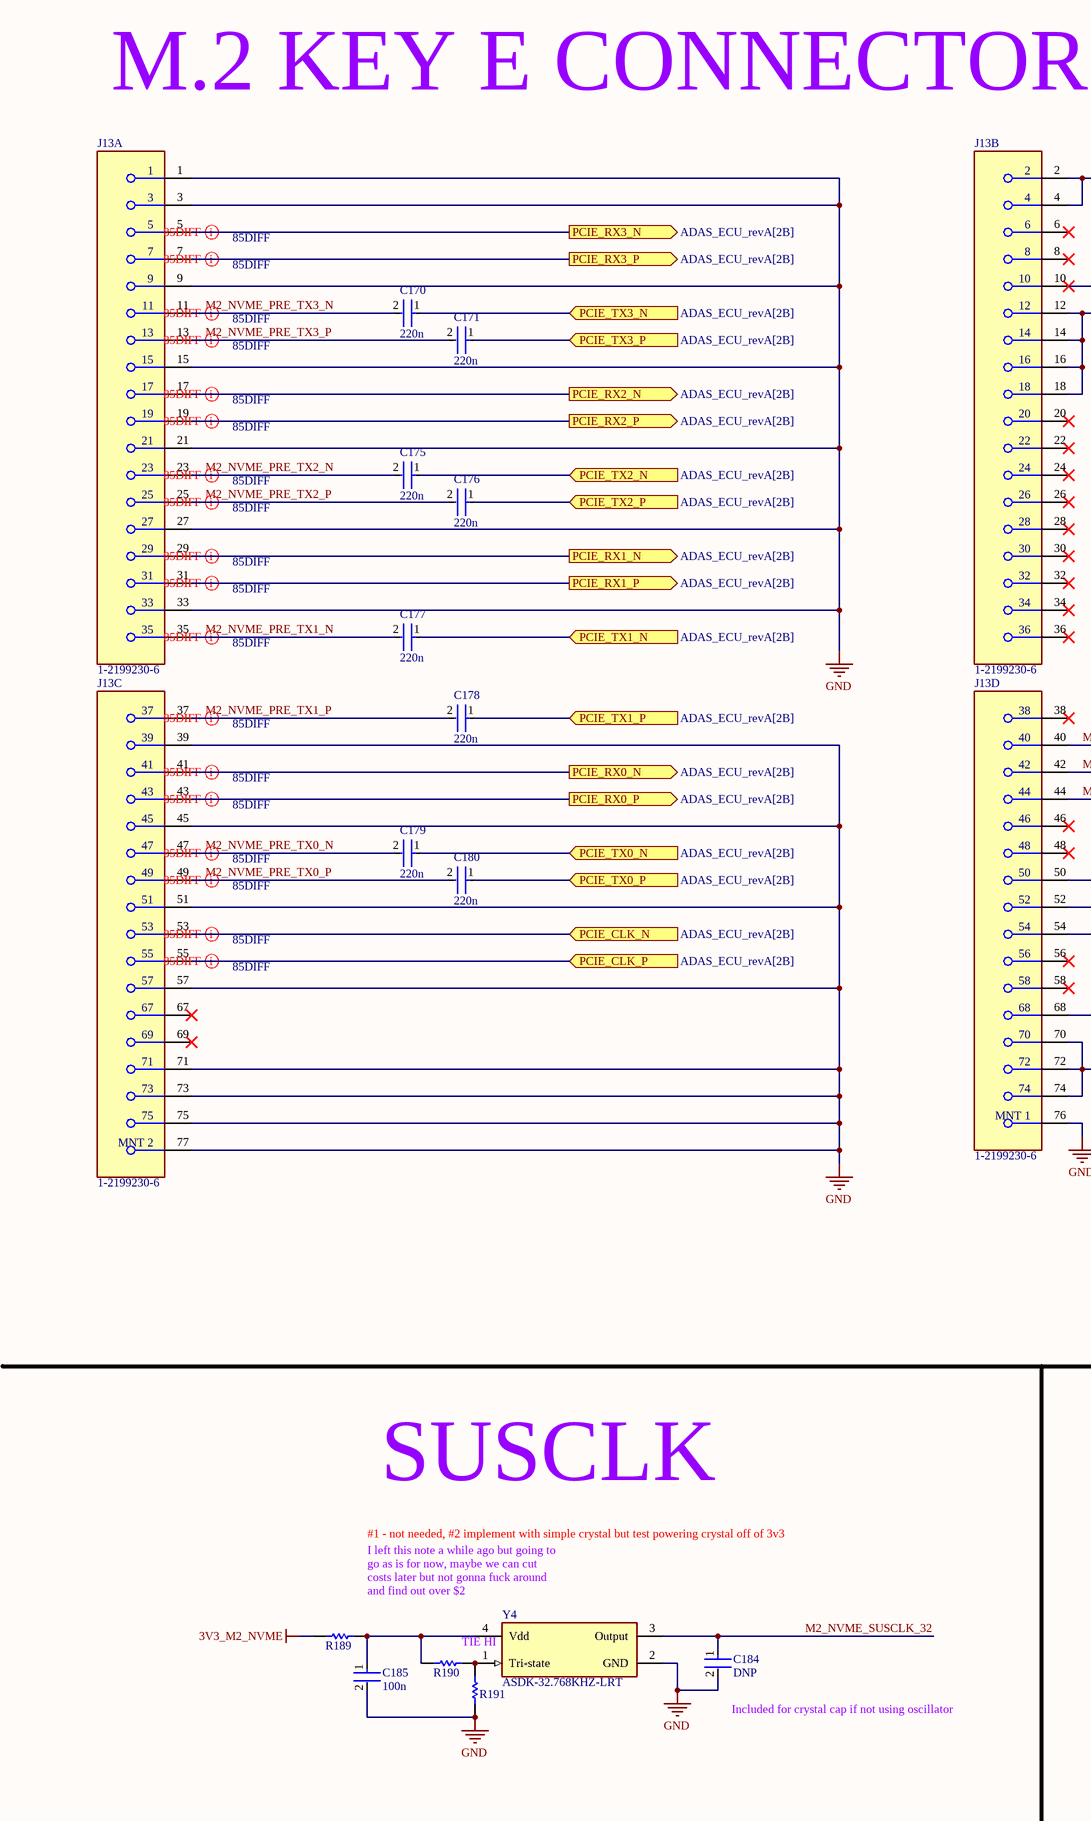
[diagram p18: M2_NVME.SchDoc, left]
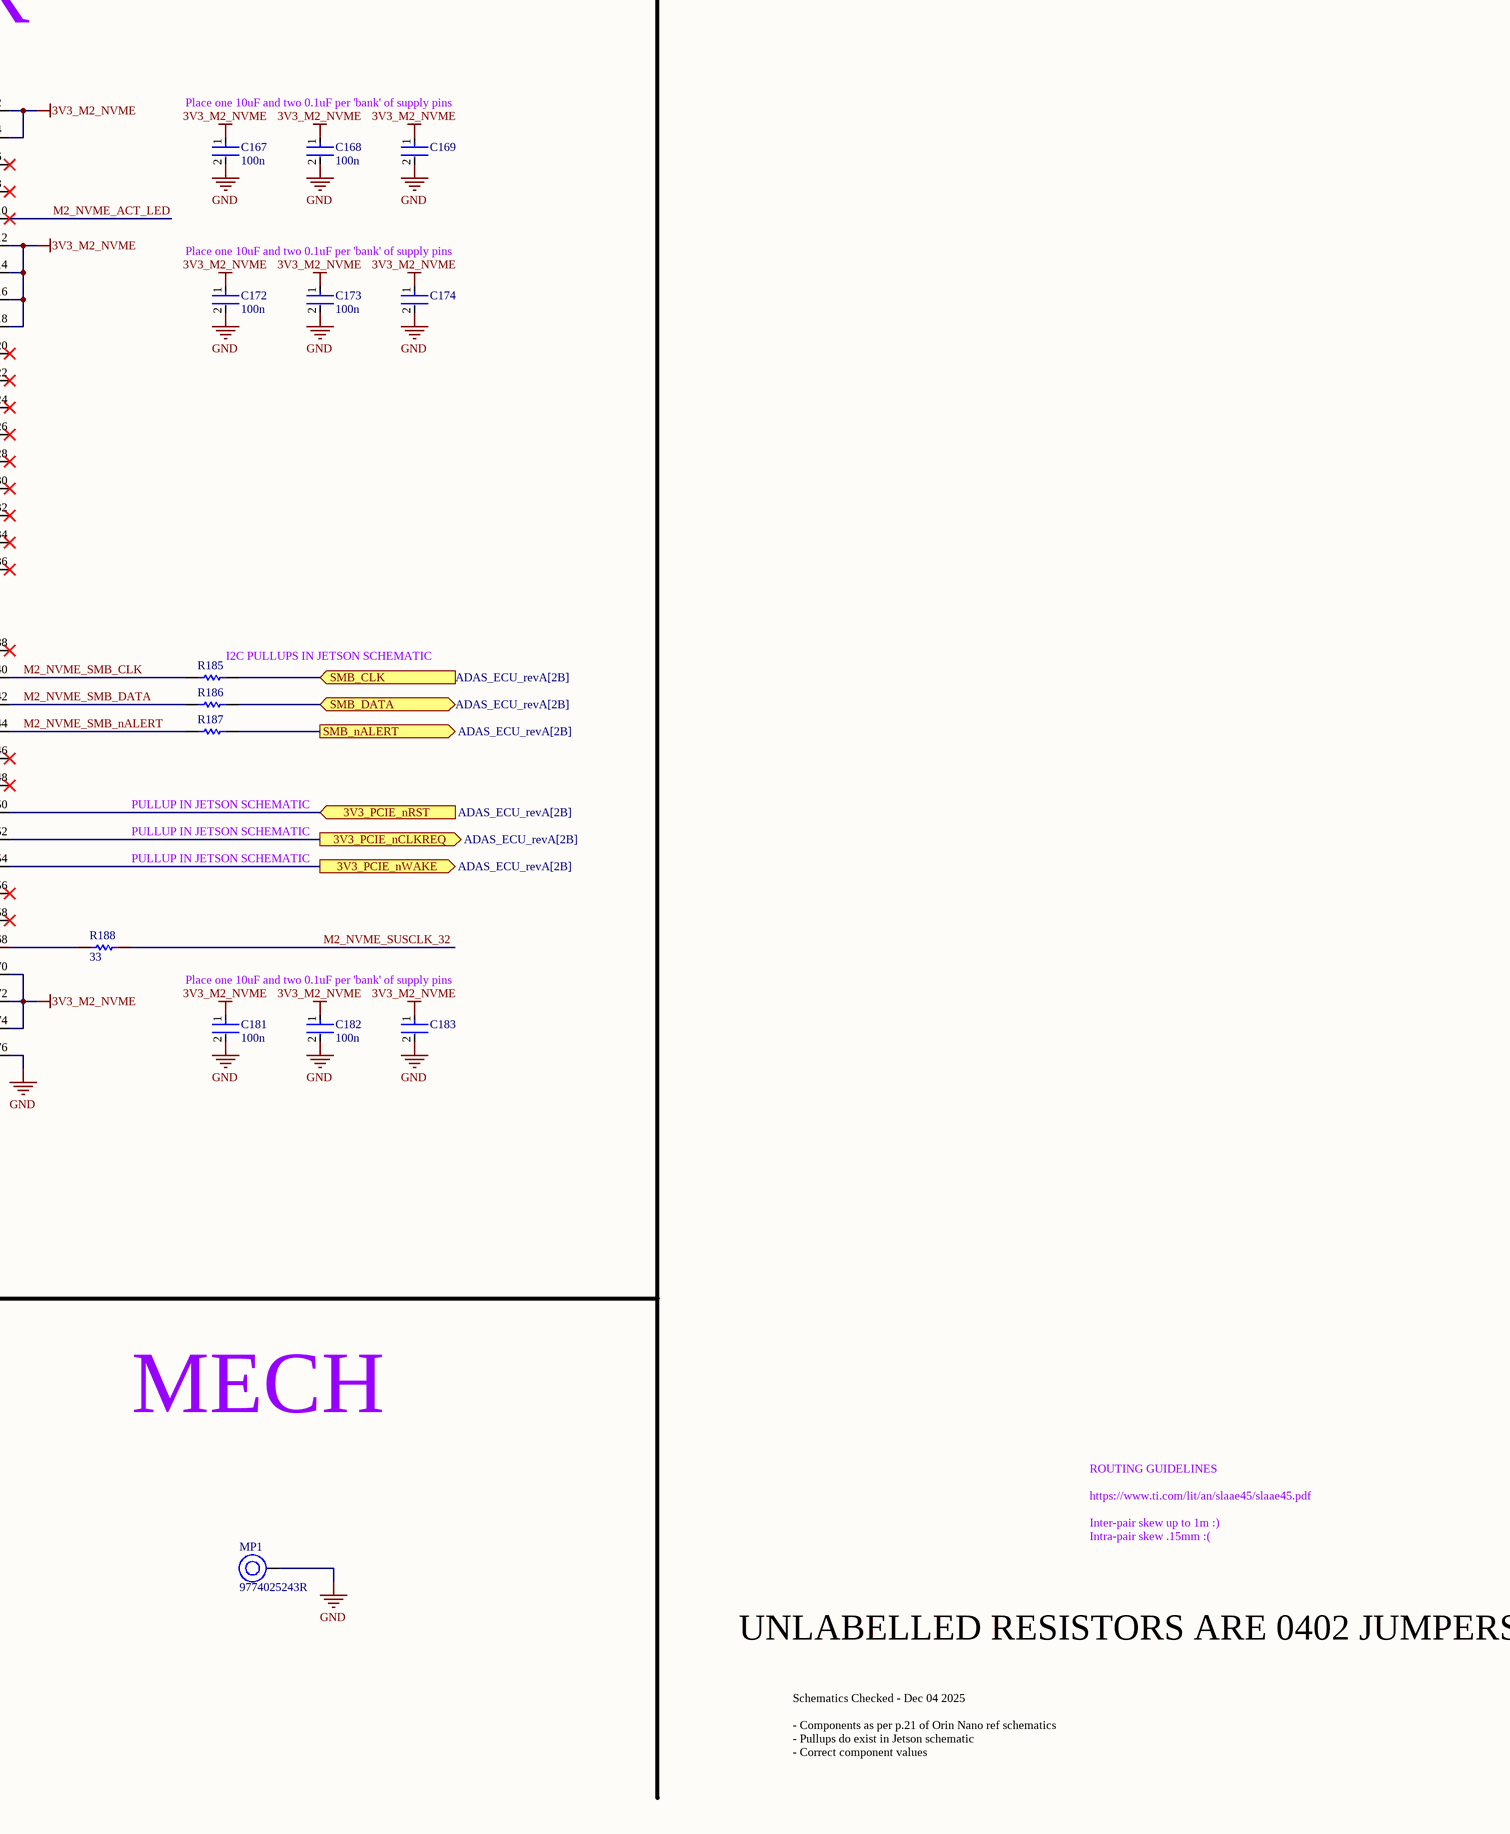
[diagram p19: M2_NVME.SchDoc, right]

### Parts
C167  100n  [FP-0402-L_1_0_0_05-W_0_5-IPC_A]
C168  100n  [FP-0402-L_1_0_0_05-W_0_5-IPC_A]
C169  GRM188R60J106ME47D  [FP-GRM188-0_1-e0_2_0_55-IPC_A]  (value not drawn)
C170  220n  [FP-0402-L_1_0_0_05-W_0_5-IPC_A]
C171  220n  [FP-0402-L_1_0_0_05-W_0_5-IPC_A]
C172  100n  [FP-0402-L_1_0_0_05-W_0_5-IPC_A]
C173  100n  [FP-0402-L_1_0_0_05-W_0_5-IPC_A]
C174  GRM188R60J106ME47D  [FP-GRM188-0_1-e0_2_0_55-IPC_A]  (value not drawn)
C175  220n  [FP-0402-L_1_0_0_05-W_0_5-IPC_A]
C176  220n  [FP-0402-L_1_0_0_05-W_0_5-IPC_A]
C177  220n  [FP-0402-L_1_0_0_05-W_0_5-IPC_A]
C178  220n  [FP-0402-L_1_0_0_05-W_0_5-IPC_A]
C179  220n  [FP-0402-L_1_0_0_05-W_0_5-IPC_A]
C180  220n  [FP-0402-L_1_0_0_05-W_0_5-IPC_A]
C181  100n  [FP-0402-L_1_0_0_05-W_0_5-IPC_A]
C182  100n  [FP-0402-L_1_0_0_05-W_0_5-IPC_A]
C183  GRM188R60J106ME47D  [FP-GRM188-0_1-e0_2_0_55-IPC_A]  (value not drawn)
C184  DNP  [FP-0402-L_1_0_0_05-W_0_5-IPC_A]
C185  100n  [FP-0402-L_1_0_0_05-W_0_5-IPC_A]
J13  1-2199230-6  [FP-1-2199230-6-MFG]  (parts A,B,C,D of 4)
MP1  9774025243R  [9774025243]
R185  DNP  [RESC1005X40X25ML05T05]  (value not drawn)
R186  DNP  [RESC1005X40X25ML05T05]  (value not drawn)
R187  DNP  [RESC1005X40X25ML05T05]  (value not drawn)
R188  33  [R0603B]
R189  0402 JUMPER  [RESC1005X40X25ML05T05]  (value not drawn)
R190  0402 JUMPER  [RESC1005X40X25ML05T05]  (value not drawn)
R191  DNP  [RESC1005X40X25ML05T05]  (value not drawn)
Y4  ASDK-32.768KHZ-LRT  [FP-ASDK-MFG]

### Ports
3V3_PCIE_nCLKREQ (out, see ADAS_ECU_revA[2B]), 3V3_PCIE_nRST (in, see ADAS_ECU_revA[2B]), 3V3_PCIE_nWAKE (out, see ADAS_ECU_revA[2B]), PCIE_CLK_N (in, see ADAS_ECU_revA[2B]), PCIE_CLK_P (in, see ADAS_ECU_revA[2B]), PCIE_RX0_N (out, see ADAS_ECU_revA[2B]), PCIE_RX0_P (out, see ADAS_ECU_revA[2B]), PCIE_RX1_N (out, see ADAS_ECU_revA[2B]), PCIE_RX1_P (out, see ADAS_ECU_revA[2B]), PCIE_RX2_N (out, see ADAS_ECU_revA[2B]), PCIE_RX2_P (out, see ADAS_ECU_revA[2B]), PCIE_RX3_N (out, see ADAS_ECU_revA[2B]), PCIE_RX3_P (out, see ADAS_ECU_revA[2B]), PCIE_TX0_N (in, see ADAS_ECU_revA[2B]), PCIE_TX0_P (in, see ADAS_ECU_revA[2B]), PCIE_TX1_N (in, see ADAS_ECU_revA[2B]), PCIE_TX1_P (in, see ADAS_ECU_revA[2B]), PCIE_TX2_N (in, see ADAS_ECU_revA[2B]), PCIE_TX2_P (in, see ADAS_ECU_revA[2B]), PCIE_TX3_N (in, see ADAS_ECU_revA[2B]), PCIE_TX3_P (in, see ADAS_ECU_revA[2B]), SMB_CLK (in, see ADAS_ECU_revA[2B]), SMB_DATA (bidir, see ADAS_ECU_revA[2B]), SMB_nALERT (out, see ADAS_ECU_revA[2B])

### Nets
3V3_M2_NVME: C167.1 C168.1 C169.1 C172.1 C173.1 C174.1 C181.1 C182.1 C183.1 J13.2 J13.4 J13.12 J13.14 J13.16 J13.18 J13.70 J13.72 J13.74 R189.1
GND: C167.2 C168.2 C169.2 C172.2 C173.2 C174.2 C181.2 C182.2 C183.2 C184.2 C185.2 J13.1 J13.3 J13.9 J13.15 J13.21 J13.27 J13.33 J13.39 J13.45 J13.51 J13.57 J13.71 J13.73 J13.75 J13.76(MNT_1) J13.77(MNT_2) MP1.1 R191.1 Y4.2(GND)
3V3_PCIE0_nWAKE: J13.52 ; port 3V3_PCIE_nCLKREQ
M2_NVME_ACT_LED: J13.10
M2_NVME_PRE_TX0_N: C179.2 J13.47
M2_NVME_PRE_TX0_P: C180.2 J13.49
M2_NVME_PRE_TX1_N: C177.2 J13.35
M2_NVME_PRE_TX1_P: C178.2 J13.37
M2_NVME_PRE_TX2_N: C175.2 J13.23
M2_NVME_PRE_TX2_P: C176.2 J13.25
M2_NVME_PRE_TX3_N: C170.2 J13.11
M2_NVME_PRE_TX3_P: C171.2 J13.13
M2_NVME_SMB_CLK: J13.40 R185.1
M2_NVME_SMB_DATA: J13.42 R186.1
M2_NVME_SMB_nALERT: J13.44 R187.1
M2_NVME_SUSCLK_32: C184.1 R188.1 Y4.3(Output)
NetC170_1: C170.1 ; port PCIE_TX3_N
NetC171_1: C171.1 ; port PCIE_TX3_P
NetC175_1: C175.1 ; port PCIE_TX2_N
NetC176_1: C176.1 ; port PCIE_TX2_P
NetC177_1: C177.1 ; port PCIE_TX1_N
NetC178_1: C178.1 ; port PCIE_TX1_P
NetC179_1: C179.1 ; port PCIE_TX0_N
NetC180_1: C180.1 ; port PCIE_TX0_P
NetC185_1: C185.1 R189.2 R190.1 Y4.4(Vdd)
NetJ13_5: J13.5 ; port PCIE_RX3_N
NetJ13_7: J13.7 ; port PCIE_RX3_P
NetJ13_17: J13.17 ; port PCIE_RX2_N
NetJ13_19: J13.19 ; port PCIE_RX2_P
NetJ13_29: J13.29 ; port PCIE_RX1_N
NetJ13_31: J13.31 ; port PCIE_RX1_P
NetJ13_41: J13.41 ; port PCIE_RX0_N
NetJ13_43: J13.43 ; port PCIE_RX0_P
NetJ13_50: J13.50 ; port 3V3_PCIE_nRST
NetJ13_53: J13.53 ; port PCIE_CLK_N
NetJ13_54: J13.54 ; port 3V3_PCIE_nWAKE
NetJ13_55: J13.55 ; port PCIE_CLK_P
NetJ13_68: J13.68 R188.2
NetR185_2: R185.2 ; port SMB_CLK
NetR186_2: R186.2 ; port SMB_DATA
NetR187_2: R187.2 ; port SMB_nALERT
NetR190_2: R190.2 R191.2 Y4.1(Tri-state)

Not connected (* = marked no-connect by the designer): J13 6* 8* 20* 22* 24* 26* 28* 30* 32* 34* 36* 38* 46* 48* 56* 58* 67* 69*

### Layout directives
differential pair; differential pair class 85DIFF: M2_NVME_PRE_TX0_N, M2_NVME_PRE_TX0_P, M2_NVME_PRE_TX1_N, M2_NVME_PRE_TX1_P, M2_NVME_PRE_TX2_N, M2_NVME_PRE_TX2_P, M2_NVME_PRE_TX3_N, M2_NVME_PRE_TX3_P, NetJ13_5, NetJ13_7, NetJ13_17, NetJ13_19, NetJ13_29, NetJ13_31, NetJ13_41, NetJ13_43, NetJ13_53, NetJ13_55

### Notes on the sheet
- M.2 KEY E CONNECTOR
- Place one 10uF and two 0.1uF per 'bank' of supply pins
- (near R185) I2C PULLUPS IN JETSON SCHEMATIC
- PULLUP IN JETSON SCHEMATIC
- SUSCLK
- MECH
- #1 - not needed, #2 implement with simple crystal but test powering crystal off of 3v3
- I left this note a while ago but going to go as is for now, maybe we can cut costs later but not gonna fuck around and find out over $2
- (near Y4) TIE HI
- ROUTING GUIDELINES
  https://www.ti.com/lit/an/slaae45/slaae45.pdf
  Inter-pair skew up to 1m :)
  Intra-pair skew .15mm :(
- (near C184) Included for crystal cap if not using oscillator
- UNLABELLED RESISTORS ARE 0402 JUMPERS
- Schematics Checked - Dec 04 2025
  - Components as per p.21 of Orin Nano ref schematics
  - Pullups do exist in Jetson schematic
  - Correct component values

### Library data of the parts
C167 C168 C170-C173 C175-C182 C184 C185 = CMP-001-00058-1: as C201 on sheet MAX96751_PINOUT; Min Operating Temperature: -55°C; Mounting Technology: Surface Mount; Pins: 2; Case/Package: 0402; RoHS Compliant: Yes; Max Operating Temperature: 85°C
C169 C174 C183 = CMP-2006-02792-2: as C212 on sheet MAX96751_PINOUT; Packaging: Tape and Reel; Voltage Rating (DC): 6.3V; Width: 0.031inch; Termination: SMD/SMT; Dielectric: X5R; Package Quantity: 4000; Voltage Rating: 6.3V; Capacitance: 10uF; Case/Package: 0603; Min Operating Temperature: -55°C; Voltage: 6.3V; Length: 1.6mm; Thickness: 0.035inch; Lead Free: Lead Free; Depth: 0.8mm; Case Code (Imperial): 0603; Max Operating Temperature: 85°C; Material: Ceramic; Height: 0.8mm; Tolerance: 20%; Mount: Surface Mount; REACH SVHC: No SVHC; Radiation Hardening: No; Case Code (Metric): 1608
J13 = CMP-03365-000001-1: CONN EDGE DUAL FMALE 67POS 0.020; Manufacturer: TE; Number Of Contacts: 67; Current Rating: 0.5A; Pitch: 0.5mm; Conn Gender: Female; Is Female: yes; Voltage Rating: 50V; Conn Orientation: Right Angle; Automotive: No; Temperature Range High: +80°C; Package: 1-2199230-6; Category: Conn; Temperature: -40°C to +80°C; Number Of Rows: 2; ComponentLink2URL: http://www.te.com/commerce/DocumentDelivery/DDEController?Action=showdoc&DocId=Specification+Or+Standard%7F114-115006%7FB%7Fpdf%7FEnglish%7FENG_SS_114-115006_B_114-115006_REV_B.pdf%7F1-2199230-6; Manufacturer Part Number: 1-2199230-6; Height: 4.2mm; RoHS: TRUE; Footprint Url: http://www.te.com/commerce/DocumentDelivery/DDEController?Action=showdoc&DocId=Customer+Drawing%7F2199230%7FB2%7Fpdf%7FEnglish%7FENG_CD_2199230_B2.pdf%7F1-2199230-6; Digikey Description: CONN EDGE DUAL FMALE 67POS 0.020; Device Class L2: Card Edge Connectors; Contact Material: Gold,Tin; Device Class L1: Connectors; Device Class L3: unset; ComponentLink2Description: Datasheet; Temperature Range Low: -40°C; Octopart: https://octopart.com/1-2199230-6-te+connectivity-34969376; Lead Free: Yes
MP1 = CMP-03913-59774857-1: 9774025243R Spacer Material: Steel, Tin-Plated Mounting: SMT Series: WA-SMST Thread D: M2; Outside Diameter: 4.3434mm; Threaded/Unthreaded: Threaded; Plating: Tin; REACH SVHC: Unknown; NexarPartId: 59774857; RoHS: Compliant; Material: Steel; Packaging: Tape and Reel; Max Operating Temperature: 150°C; Min Operating Temperature: -55°C; Length: 2.5mm; Height: 2.5mm
R185-R187 R189-R191 = CMP-009-00118-2: READ THE NAME; Pins: 2; Component Type: Standard; Design Item ID: CMP-009-00206-2; Source: 0402jump.SchLib
R188 = CMP-009-00002-14: Resistor
Y4 = CMP-27762-001115-1: XTAL OSC XO 32.7680KHZ CMOS SMD; Load Capacitance: 15pF; Max Supply Current: 3.5mA; Min Supply Voltage: 2.97V; Operating Supply Voltage: 3.3V; Frequency Stability: 25ppm; Lead Free: Lead Free; Case/Package: CSMD; Number of Pins: 4; Max Operating Temperature: 85°C; Packaging: Tape and Reel; Width: 0.079inch; Min Operating Temperature: -40°C; Radiation Hardening: No; Length: 2.5mm; Depth: 2mm; Termination: SMD/SMT; Height: 0.037inch; Series: ASDK; Frequency: 32.768kHz; Mount: Surface Mount

## Sheet M2_WIFI.SchDoc
size C; SheetNumber: 13; SheetTotal: 19
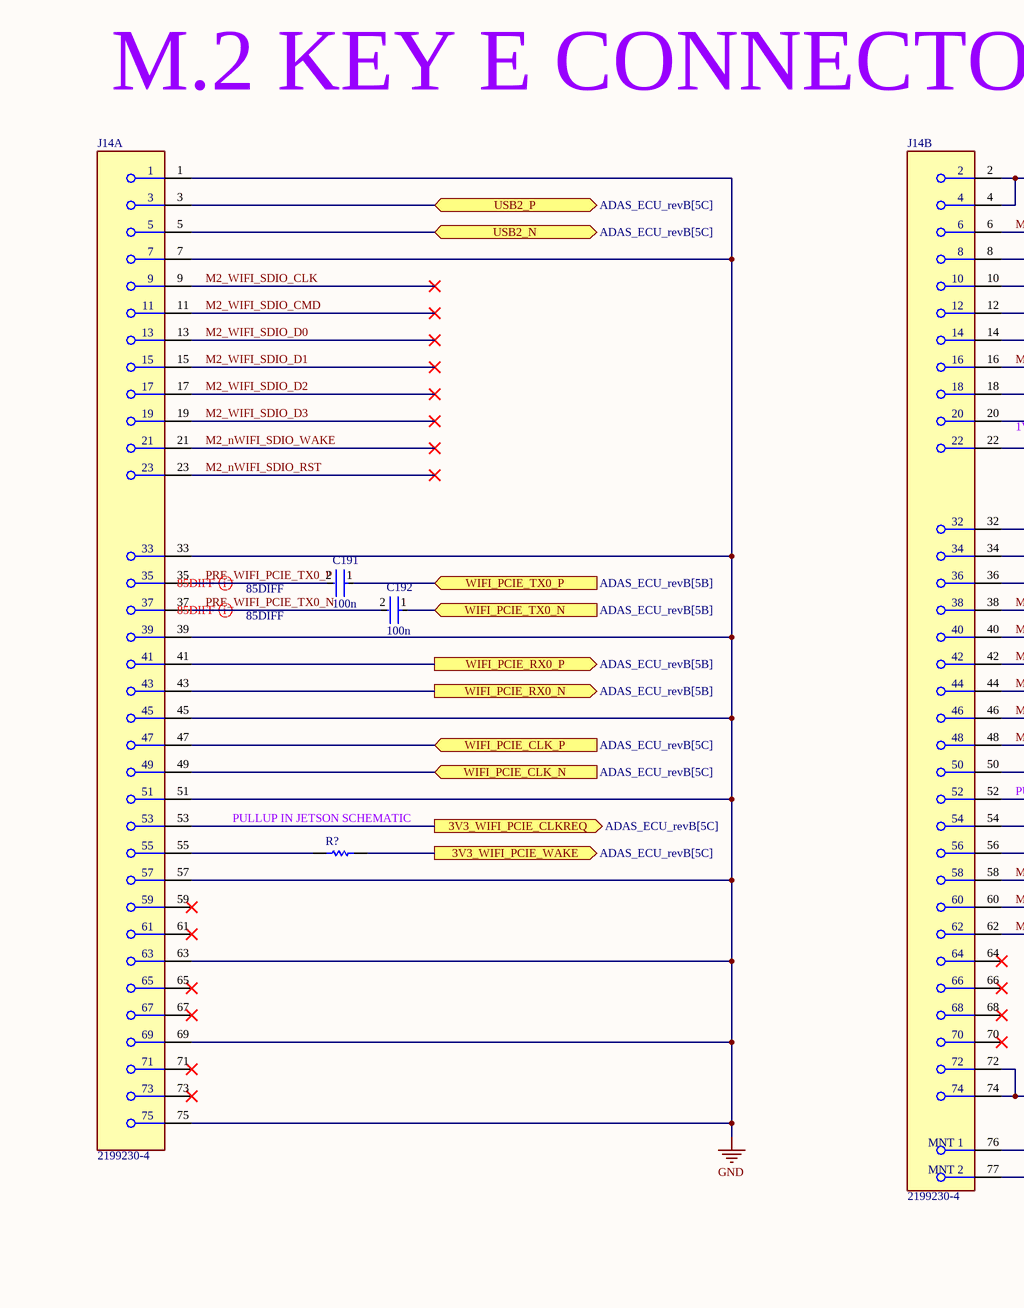
[diagram p20: M2_WIFI.SchDoc, left]
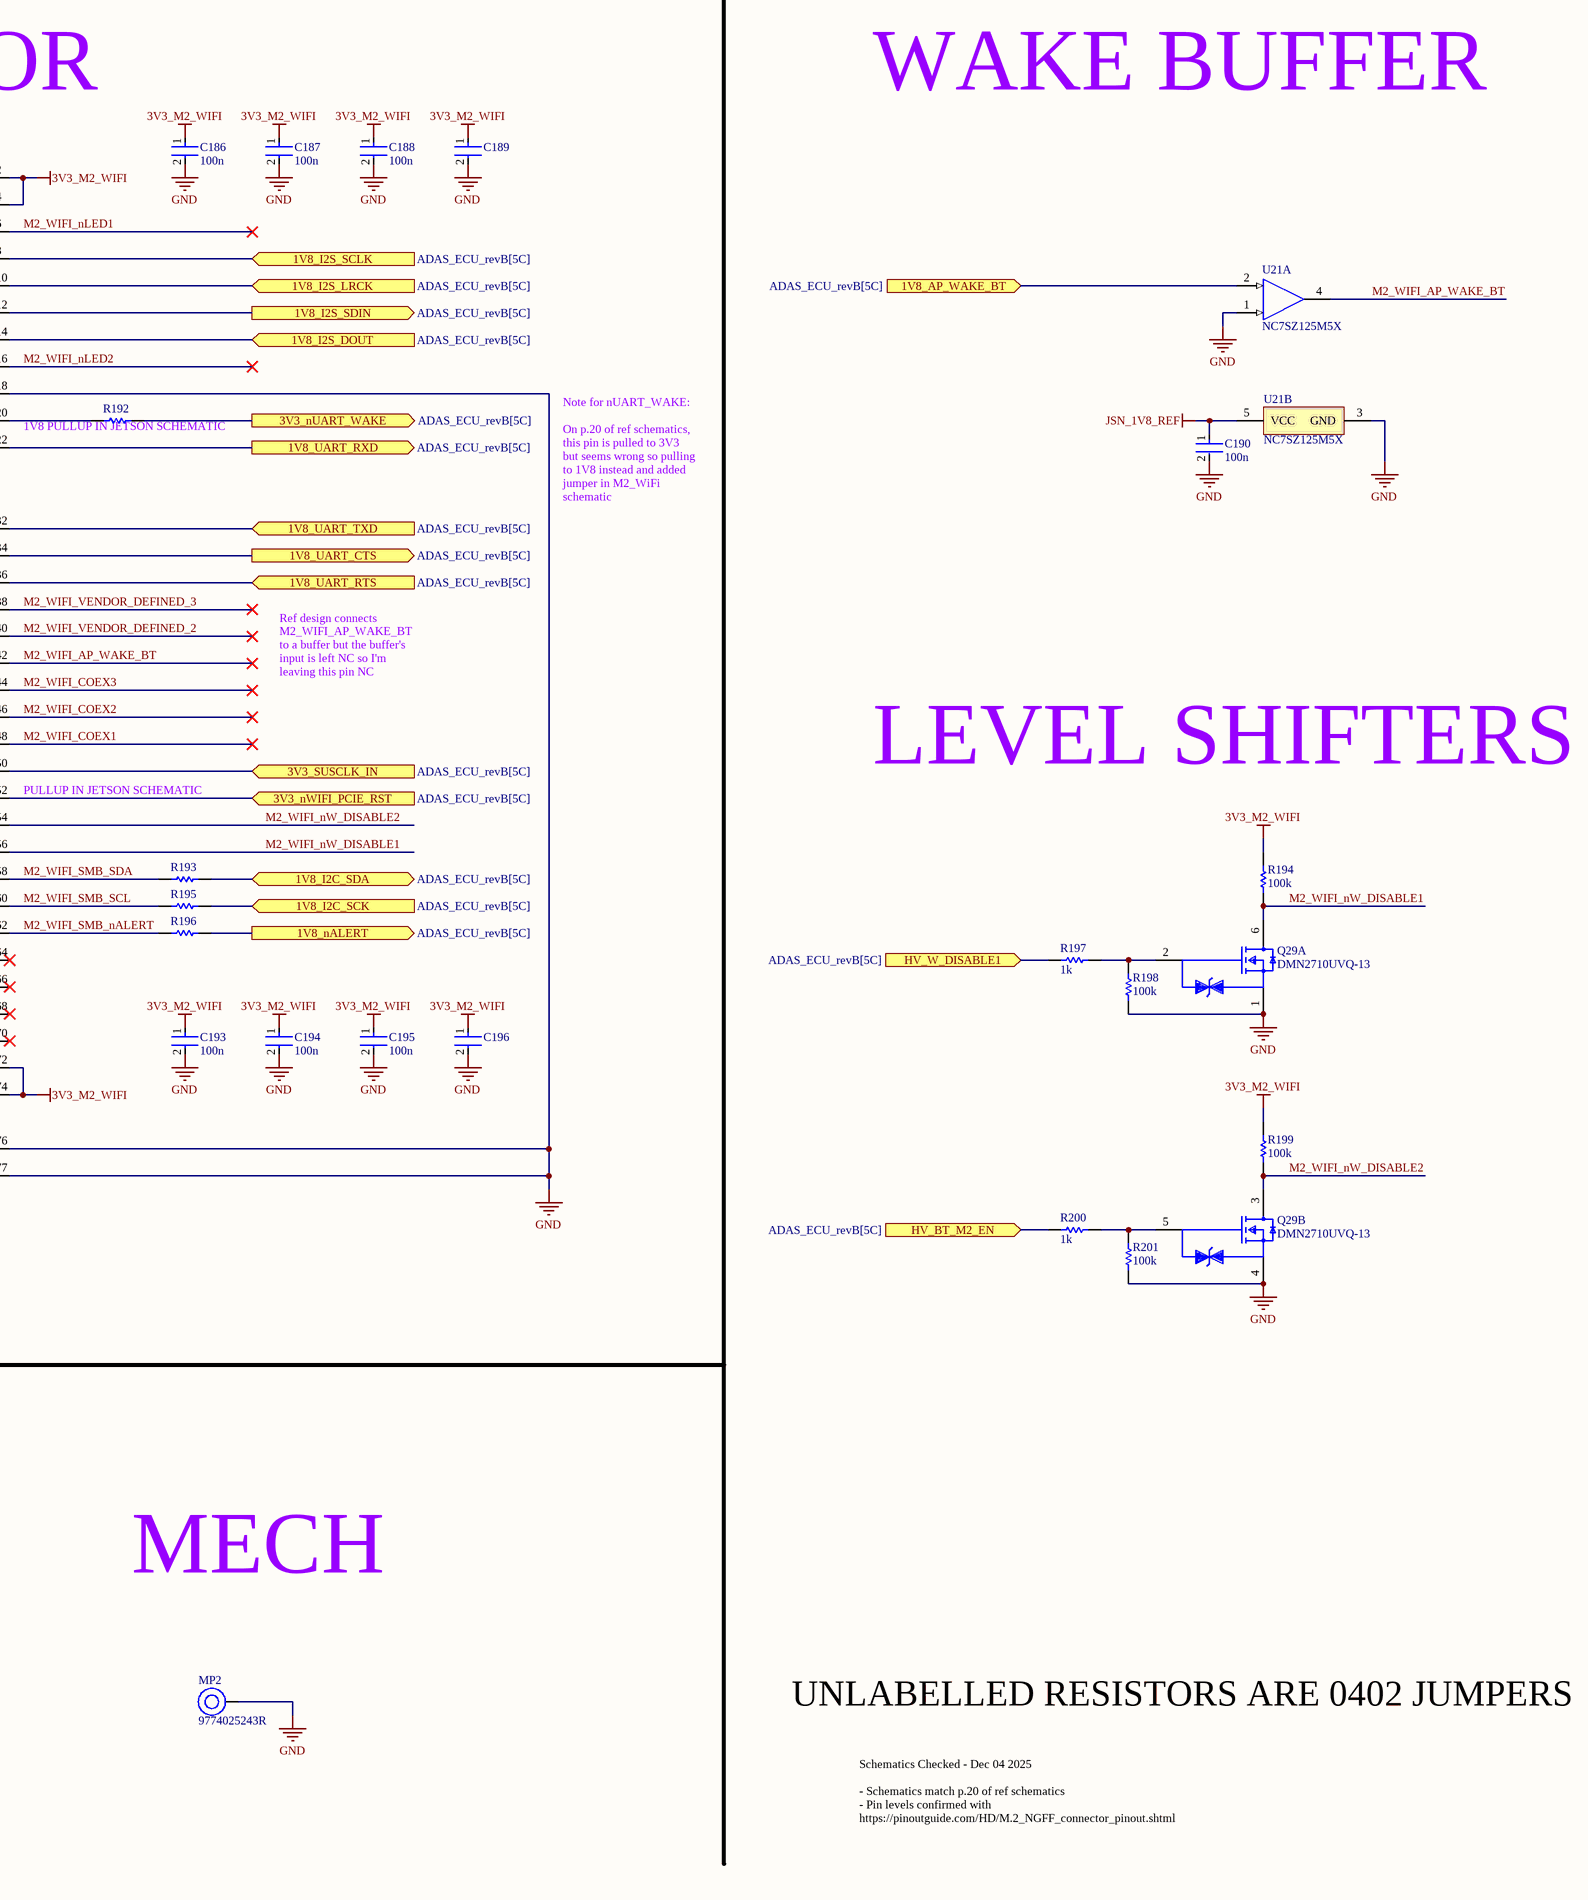
[diagram p21: M2_WIFI.SchDoc, right]

### Parts
(Parts that share a designator on the sheet are numbered #1, #2 ... from top to bottom, then left to right.)
C186  100n  [FP-0402-L_1_0_0_05-W_0_5-IPC_A]
C187  100n  [FP-0402-L_1_0_0_05-W_0_5-IPC_A]
C188  100n  [FP-0402-L_1_0_0_05-W_0_5-IPC_A]
C189  GRM188R60J106ME47D  [FP-GRM188-0_1-e0_2_0_55-IPC_A]  (value not drawn)
C190  100n  [FP-0402-L_1_0_0_05-W_0_5-IPC_A]
C191  100n  [FP-0402-L_1_0_0_05-W_0_5-IPC_A]
C192  100n  [FP-0402-L_1_0_0_05-W_0_5-IPC_A]
C193  100n  [FP-0402-L_1_0_0_05-W_0_5-IPC_A]
C194  100n  [FP-0402-L_1_0_0_05-W_0_5-IPC_A]
C195  100n  [FP-0402-L_1_0_0_05-W_0_5-IPC_A]
C196  GRM188R60J106ME47D  [FP-GRM188-0_1-e0_2_0_55-IPC_A]  (value not drawn)
J14  2199230-4  [FP-2199230-4-MFG]  (parts A,B of 2)
MP2  9774025243R  [9774025243]
Q29  DMN2710UVQ-13  [SOTFL50P162X60-6N]  (parts A,B of 2)
R192  0402 JUMPER  [RESC1005X40X25ML05T05]  (value not drawn)
R193  DNP  [RESC1005X40X25ML05T05]  (value not drawn)
R194  100k  [R0603B]
R195  DNP  [RESC1005X40X25ML05T05]  (value not drawn)
R196  DNP  [RESC1005X40X25ML05T05]  (value not drawn)
R197  1k  [R0603B]
R198  100k  [R0603B]
R199  100k  [R0603B]
R200  1k  [R0603B]
R201  100k  [R0603B]
R?#25  0402 JUMPER  [RESC1005X40X25ML05T05]  (value not drawn)
U21  NC7SZ125M5X  [FAIR-SOT23-5_V]  (parts A,B of 2)

### Ports
1V8_AP_WAKE_BT (in, see ADAS_ECU_revB[5C]), 1V8_I2C_SCK (in, see ADAS_ECU_revB[5C]), 1V8_I2C_SDA (bidir, see ADAS_ECU_revB[5C]), 1V8_I2S_DOUT (in, see ADAS_ECU_revB[5C]), 1V8_I2S_LRCK (in, see ADAS_ECU_revB[5C]), 1V8_I2S_SCLK (in, see ADAS_ECU_revB[5C]), 1V8_I2S_SDIN (out, see ADAS_ECU_revB[5C]), 1V8_nALERT (out, see ADAS_ECU_revB[5C]), 1V8_UART_CTS (out, see ADAS_ECU_revB[5C]), 1V8_UART_RTS (in, see ADAS_ECU_revB[5C]), 1V8_UART_RXD (out, see ADAS_ECU_revB[5C]), 1V8_UART_TXD (in, see ADAS_ECU_revB[5C]), 3V3_nUART_WAKE (out, see ADAS_ECU_revB[5C]), 3V3_nWIFI_PCIE_RST (in, see ADAS_ECU_revB[5C]), 3V3_SUSCLK_IN (in, see ADAS_ECU_revB[5C]), 3V3_WIFI_PCIE_CLKREQ (out, see ADAS_ECU_revB[5C]), 3V3_WIFI_PCIE_WAKE (out, see ADAS_ECU_revB[5C]), HV_BT_M2_EN (in, see ADAS_ECU_revB[5C]), HV_W_DISABLE1 (in, see ADAS_ECU_revB[5C]), USB2_N (bidir, see ADAS_ECU_revB[5C]), USB2_P (bidir, see ADAS_ECU_revB[5C]), WIFI_PCIE_CLK_N (in, see ADAS_ECU_revB[5C]), WIFI_PCIE_CLK_P (in, see ADAS_ECU_revB[5C]), WIFI_PCIE_RX0_N (out, see ADAS_ECU_revB[5B]), WIFI_PCIE_RX0_P (out, see ADAS_ECU_revB[5B]), WIFI_PCIE_TX0_N (in, see ADAS_ECU_revB[5B]), WIFI_PCIE_TX0_P (in, see ADAS_ECU_revB[5B])

### Nets
3V3_M2_WIFI: C186.1 C187.1 C188.1 C189.1 C193.1 C194.1 C195.1 C196.1 J14.2 J14.4 J14.72 J14.74 R194.2 R199.2
GND: C186.2 C187.2 C188.2 C189.2 C190.2 C193.2 C194.2 C195.2 C196.2 J14.1 J14.7 J14.18 J14.33 J14.39 J14.45 J14.51 J14.57 J14.63 J14.69 J14.75 J14.76(MNT_1) J14.77(MNT_2) MP2.1 Q29.1(Source1) Q29.4(Source2) R198.1 R201.1 U21.1(~{OE}) U21.3(GND)
JSN_1V8_REF: C190.1 U21.5(VCC)
3V3_PCIE0_nWAKE: R?#25.2 ; port 3V3_WIFI_PCIE_WAKE
M2_nWIFI_SDIO_RST: J14.23
M2_nWIFI_SDIO_WAKE: J14.21
M2_WIFI_AP_WAKE_BT: J14.42 U21.4(Y)
M2_WIFI_COEX1: J14.48
M2_WIFI_COEX2: J14.46
M2_WIFI_COEX3: J14.44
M2_WIFI_nLED1: J14.6
M2_WIFI_nLED2: J14.16
M2_WIFI_nW_DISABLE1: J14.56 Q29.6(Drain1) R194.1
M2_WIFI_nW_DISABLE2: J14.54 Q29.3(Drain2) R199.1
M2_WIFI_SDIO_CLK: J14.9
M2_WIFI_SDIO_CMD: J14.11
M2_WIFI_SDIO_D0: J14.13
M2_WIFI_SDIO_D1: J14.15
M2_WIFI_SDIO_D2: J14.17
M2_WIFI_SDIO_D3: J14.19
M2_WIFI_SMB_nALERT: J14.62 R196.1
M2_WIFI_SMB_SCL: J14.60 R195.1
M2_WIFI_SMB_SDA: J14.58 R193.1
M2_WIFI_VENDOR_DEFINED_2: J14.40
M2_WIFI_VENDOR_DEFINED_3: J14.38
PRE_WIFI_PCIE_TX0_N: C192.2 J14.37
PRE_WIFI_PCIE_TX0_P: C191.2 J14.35
NetC191_1: C191.1 ; port WIFI_PCIE_TX0_P
NetC192_1: C192.1 ; port WIFI_PCIE_TX0_N
NetJ14_3: J14.3 ; port USB2_P
NetJ14_5: J14.5 ; port USB2_N
NetJ14_8: J14.8 ; port 1V8_I2S_SCLK
NetJ14_10: J14.10 ; port 1V8_I2S_LRCK
NetJ14_12: J14.12 ; port 1V8_I2S_SDIN
NetJ14_14: J14.14 ; port 1V8_I2S_DOUT
NetJ14_20: J14.20 R192.1
NetJ14_22: J14.22 ; port 1V8_UART_RXD
NetJ14_32: J14.32 ; port 1V8_UART_TXD
NetJ14_34: J14.34 ; port 1V8_UART_CTS
NetJ14_36: J14.36 ; port 1V8_UART_RTS
NetJ14_41: J14.41 ; port WIFI_PCIE_RX0_P
NetJ14_43: J14.43 ; port WIFI_PCIE_RX0_N
NetJ14_47: J14.47 ; port WIFI_PCIE_CLK_P
NetJ14_49: J14.49 ; port WIFI_PCIE_CLK_N
NetJ14_50: J14.50 ; port 3V3_SUSCLK_IN
NetJ14_52: J14.52 ; port 3V3_nWIFI_PCIE_RST
NetJ14_53: J14.53 ; port 3V3_WIFI_PCIE_CLKREQ
NetJ14_55: J14.55 R?#25.1
NetQ29_2: Q29.2(Gate1) R197.1 R198.2
NetQ29_5: Q29.5(Gate2) R200.1 R201.2
NetR192_2: R192.2 ; port 3V3_nUART_WAKE
NetR193_2: R193.2 ; port 1V8_I2C_SDA
NetR195_2: R195.2 ; port 1V8_I2C_SCK
NetR196_2: R196.2 ; port 1V8_nALERT
NetR197_2: R197.2 ; port HV_W_DISABLE1
NetR200_2: R200.2 ; port HV_BT_M2_EN
NetU21_2: U21.2(A) ; port 1V8_AP_WAKE_BT

Not connected (* = marked no-connect by the designer): J14 59* 61* 64* 65* 66* 67* 68* 70* 71* 73*

### Layout directives
differential pair; differential pair class 85DIFF: PRE_WIFI_PCIE_TX0_N, PRE_WIFI_PCIE_TX0_P

### Notes on the sheet
- M.2 KEY E CONNECTOR
- WAKE BUFFER
- (near R192) 1V8 PULLUP IN JETSON SCHEMATIC
- Note for nUART_WAKE:
  On p.20 of ref schematics, this pin is pulled to 3V3 but seems wrong so pulling to 1V8 instead and added jumper in M2_WiFi schematic
- Ref design connects M2_WIFI_AP_WAKE_BT to a buffer but the buffer's input is left NC so I'm leaving this pin NC
- LEVEL SHIFTERS
- (near R?#25) PULLUP IN JETSON SCHEMATIC
- (near J14) PULLUP IN JETSON SCHEMATIC
- MECH
- UNLABELLED RESISTORS ARE 0402 JUMPERS
- Schematics Checked - Dec 04 2025
  - Schematics match p.20 of ref schematics
  - Pin levels confirmed with https://pinoutguide.com/HD/M.2_NGFF_connector_pinout.shtml

### Library data of the parts
C186-C188 C190-C195 = CMP-001-00058-1: as C201 on sheet MAX96751_PINOUT; Min Operating Temperature: -55°C; Mounting Technology: Surface Mount; Pins: 2; Case/Package: 0402; RoHS Compliant: Yes; Max Operating Temperature: 85°C
C189 C196 = CMP-2006-02792-2: as C212 on sheet MAX96751_PINOUT; Packaging: Tape and Reel; Voltage Rating (DC): 6.3V; Width: 0.031inch; Termination: SMD/SMT; Dielectric: X5R; Package Quantity: 4000; Voltage Rating: 6.3V; Capacitance: 10uF; Case/Package: 0603; Min Operating Temperature: -55°C; Voltage: 6.3V; Length: 1.6mm; Thickness: 0.035inch; Lead Free: Lead Free; Depth: 0.8mm; Case Code (Imperial): 0603; Max Operating Temperature: 85°C; Material: Ceramic; Height: 0.8mm; Tolerance: 20%; Mount: Surface Mount; REACH SVHC: No SVHC; Radiation Hardening: No; Case Code (Metric): 1608
J14 = CMP-03365-000002-1: CONN FEMALE 67POS 0.020 GOLD; Manufacturer: TE Connectivity; Conn Orientation: Right Angle; Pitch: 0.5mm; Number Of Contacts: 67; Voltage Rating: 50V; Is Female: yes; Current Rating: 0.5A; Lead Free: Yes; Temperature Range Low: -40°C; Device Class L3: unset; Package: 0; Manufacturer Part Number: 2199230-4; RoHS: TRUE; Digikey Description: CONN FEMALE 67POS 0.020 GOLD; Category: Conn; Device Class L1: Connectors; Temperature Range High: +80°C; ComponentLink2Description: Datasheet; ComponentLink2URL: https://www.te.com/commerce/DocumentDelivery/DDEController?Action=showdoc&DocId=Customer+Drawing%7F2199230%7FB3%7Fpdf%7FEnglish%7FENG_CD_2199230_B3.pdf%7F2199230-4; Mouser Description: PCI Express / PCI Connectors .5PITCH 4.2H KEY E EMBOSS NGFF MINICARD; Automotive: No; Conn Gender: Female; Height: 4.2mm; Device Class L2: Card Edge Connectors; Contact Material: Gold,Nickel; Number Of Rows: 2; Octopart: https://octopart.com/2199230-4-te+connectivity-46436156; Temperature: -40°C to +80°C
MP2 = CMP-03913-59774857-1: as MP1 on sheet M2_NVME; REACH SVHC: Unknown; NexarPartId: 59774857; RoHS: Compliant; Material: Steel; Packaging: Tape and Reel; Max Operating Temperature: 150°C; Min Operating Temperature: -55°C; Length: 2.5mm; Height: 2.5mm
Q29 = CMP-013-00023-2: as Q30 on sheet MAX96751_PINOUT; Max Operating Temperature: 150°C; Min Operating Temperature: -55°C
R192 R193 R195 R196 R?#25 = CMP-009-00118-2: READ THE NAME; Pins: 2; Component Type: Standard; Design Item ID: CMP-009-00206-2; Source: 0402jump.SchLib
R194 R197-R201 = CMP-009-00002-14: Resistor
U21 = CMP-2000-06816-1: TinyLogic UHS Buffer with Three-State Output, 1.65 to 5.5 V, -40 to 85 degC, 5-Pin SOT23, RoHS, Tape and Reel; Manufacturer: Fairchild Semiconductor; Input Signal Type: Single-Ended; Maximum Operating Supply Voltage: 5.5V; Number of Outputs per Chip: 1; Maximum Propagation Delay Time @ Maximum CL: 5.7@3.3V; Minimum Operating Supply Voltage: 1.65V; Maximum Quiescent Current: 2uA; Propagation Delay Test Condition: 50pF; Lead Finish: MatteTin; Number of Output Enables per Chip: 1Low; Maximum Low Level Output Current: 32mA; Output Type: 3-State; Package Version: 08/2015; Max Processing Temp: 260; Maximum High Level Output Current: -32mA; Tolerant I/Os: 5V; Bus Hold: No; Fabrication Technology: CMOS; Polarity: Non-Inverting; Typical Operating Supply Voltage: 1.8; Logic Function: Buffer/LineDriver; Manufacturer URL: https://www.fairchildsemi.com/; Mounting: SurfaceMount; Number of Channels per Chip: 1; Package Description: 5-Pin Small Outline Transistor, Body 2.9 x 1.6 mm, Pitch 0.95 mm; Package Reference: SOT23-5; Number of Elements per Chip: 1; Package URL: https://www.fairchildsemi.com/package-drawings/MA/MA05B.pdf; Datasheet URL: https://www.fairchildsemi.com/datasheets/NC/NC7SZ125.pdf; Datasheet Version: Rev. 1.0.5, 01/2014; Mounting Technology: SurfaceMount; Operating Temperature: -40to85C; Number of Inputs per Chip: 1

## Sheet RAIL_DISCHARGE.SchDoc
size A4; SheetNumber: 4; SheetTotal: 19
Used 3 times, as channels RAIL_DISCH_0, RAIL_DISCH_1, RAIL_DISCH_2. Parts and nets are listed once, with the designators drawn on the sheet.
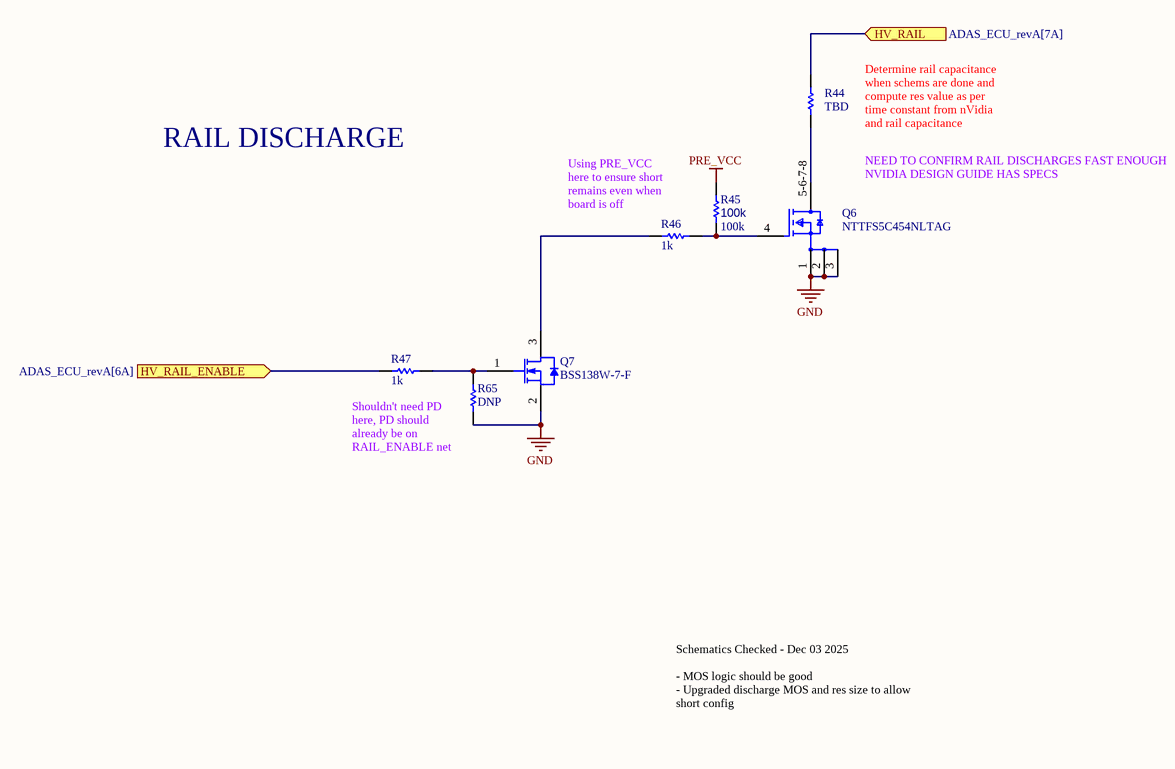
[diagram p22: RAIL_DISCHARGE.SchDoc]

### Parts
Q6  NTTFS5C454NLTAG  [FP-511AB-MFG]
Q7  BSS138W-7-F  [DIOD-SOT323-3_V]
R44  TBD  [R1206B]
R45  100k  [R0603B]
R46  1k  [R0603B]
R47  1k  [R0603B]
R65  DNP  [R0603B]

### Ports
HV_RAIL (in, see ADAS_ECU_revA[7A]), HV_RAIL_ENABLE (in, see ADAS_ECU_revA[6A])

### Nets
GND: Q6.1(S) Q6.2(S) Q6.3(S) Q7.2(S) R65.2
PRE_VCC: R45.2
HV_RAIL: R44.1 ; port HV_RAIL
HV_RAIL_ENABLE: R47.2 ; port HV_RAIL_ENABLE
NetQ6_4: Q6.4(G) R45.1 R46.2
NetQ6_5-6-7-8: Q6.5-6-7-8(D) R44.2
NetQ7_1: Q7.1(G) R47.1 R65.1
NetQ7_3: Q7.3(D) R46.1

### Channels
RAIL_DISCH_0: designators end in _RAIL_DISCH_0; ports HV_RAIL=12V0_MAIN HV_RAIL_ENABLE=3V3_12V0_MAIN_ENABLE
RAIL_DISCH_1: designators end in _RAIL_DISCH_1; ports HV_RAIL=5V0_MAIN HV_RAIL_ENABLE=3V3_5V0_MAIN_ENABLE
RAIL_DISCH_2: designators end in _RAIL_DISCH_2; ports HV_RAIL=3V3_MAIN HV_RAIL_ENABLE=3V3_3V3_MAIN_ENABLE

### Notes on the sheet
- Determine rail capacitance when schems are done and compute res value as per time constant from nVidia and rail capacitance
- RAIL DISCHARGE
- NEED TO CONFIRM RAIL DISCHARGES FAST ENOUGH
- (near Q6) NVIDIA DESIGN GUIDE HAS SPECS
- Using PRE_VCC here to ensure short remains even when board is off
- (near R65) Shouldn't need PD here, PD should already be on RAIL_ENABLE net
- Schematics Checked - Dec 03 2025
  - MOS logic should be good
  - Upgraded discharge MOS and res size to allow short config

### Library data of the parts
Q6 = CMP-00278-71475164-1: NTTFS5C454NLTAG Single N-Channel Power MOSFET 40V, 85A, 3.8mΩ Power MOSFET 40V, 85A, 3.8 mOhm, Single N-Channel, u8FL, Logic Level; Manufacturer Lifecycle Status: ACTIVE; Max Power Dissipation: 3.2W; Turn-On Delay Time: 9.3ns; Turn-Off Delay Time: 17ns; Gate to Source Voltage (Vgs): 20V; Continuous Drain Current (ID): 20A; Drain to Source Resistance: 4.8mΩ; Max Junction Temperature (Tj): 175°C; Input Capacitance: 1.6nF; Number of Channels: 1; Threshold Voltage: 2V; Lead Free: Lead Free; Drain to Source Voltage (Vdss): 40V; Schedule B: 8541290080; Number of Pins: 8; Mount: Surface Mount; Power Dissipation: 3.2W; Min Operating Temperature: -55°C; RoHS: Compliant; Drain to Source Breakdown Voltage: 40V; Max Operating Temperature: 175°C; Height: 800µm; Lifecycle Status: Production; NexarPartId: 71475164; REACH SVHC: No SVHC; Rds On Max: 3.8mΩ
Q7 = CMP-2000-05968-1: as Q31 on sheet MAX96751_PINOUT; Manufacturer URL: http://www.diodes.com/; Series: BSS138; Package Description: 3-Pin Small Outline Transistor, Body 2 x 1.25 mm, Pitch 0.65 mm; Mounting Technology: SurfaceMount; Product Category: MOSFET; RoHS: True; Maximum Operating Temperature: +150C; Height: 1mm; Length: 2.2mm; Technology: Si; Width: 1.35mm; Datasheet URL: http://www.diodes.com/_files/datasheets/ds30206.pdf; Manufacturer: DiodesIncorporated; Package / Case: SOT-323-3; Typical Turn-On Delay Time: 20ns; Transistor Polarity: N-Channel; Factory Pack Quantity: 3000; Packaging: Reel; Product: MOSFETSmallSignal; Datasheet Version: Rev. 11-2, 09/2013; Package Reference: SOT323; Minimum Operating Temperature: -55C; Mounting Style: SMD/SMT; Channel Mode: Enhancement
R44-R47 R65 = CMP-009-00002-14: Resistor
  R44: Value: TBD
  R45: Value: 100k
  R46 R47: Value: 1k
  R65: Value: DNP